# EAGLE design PrimaryLogger (EAGLE 9.6.2)

## Sheet 1 of 2
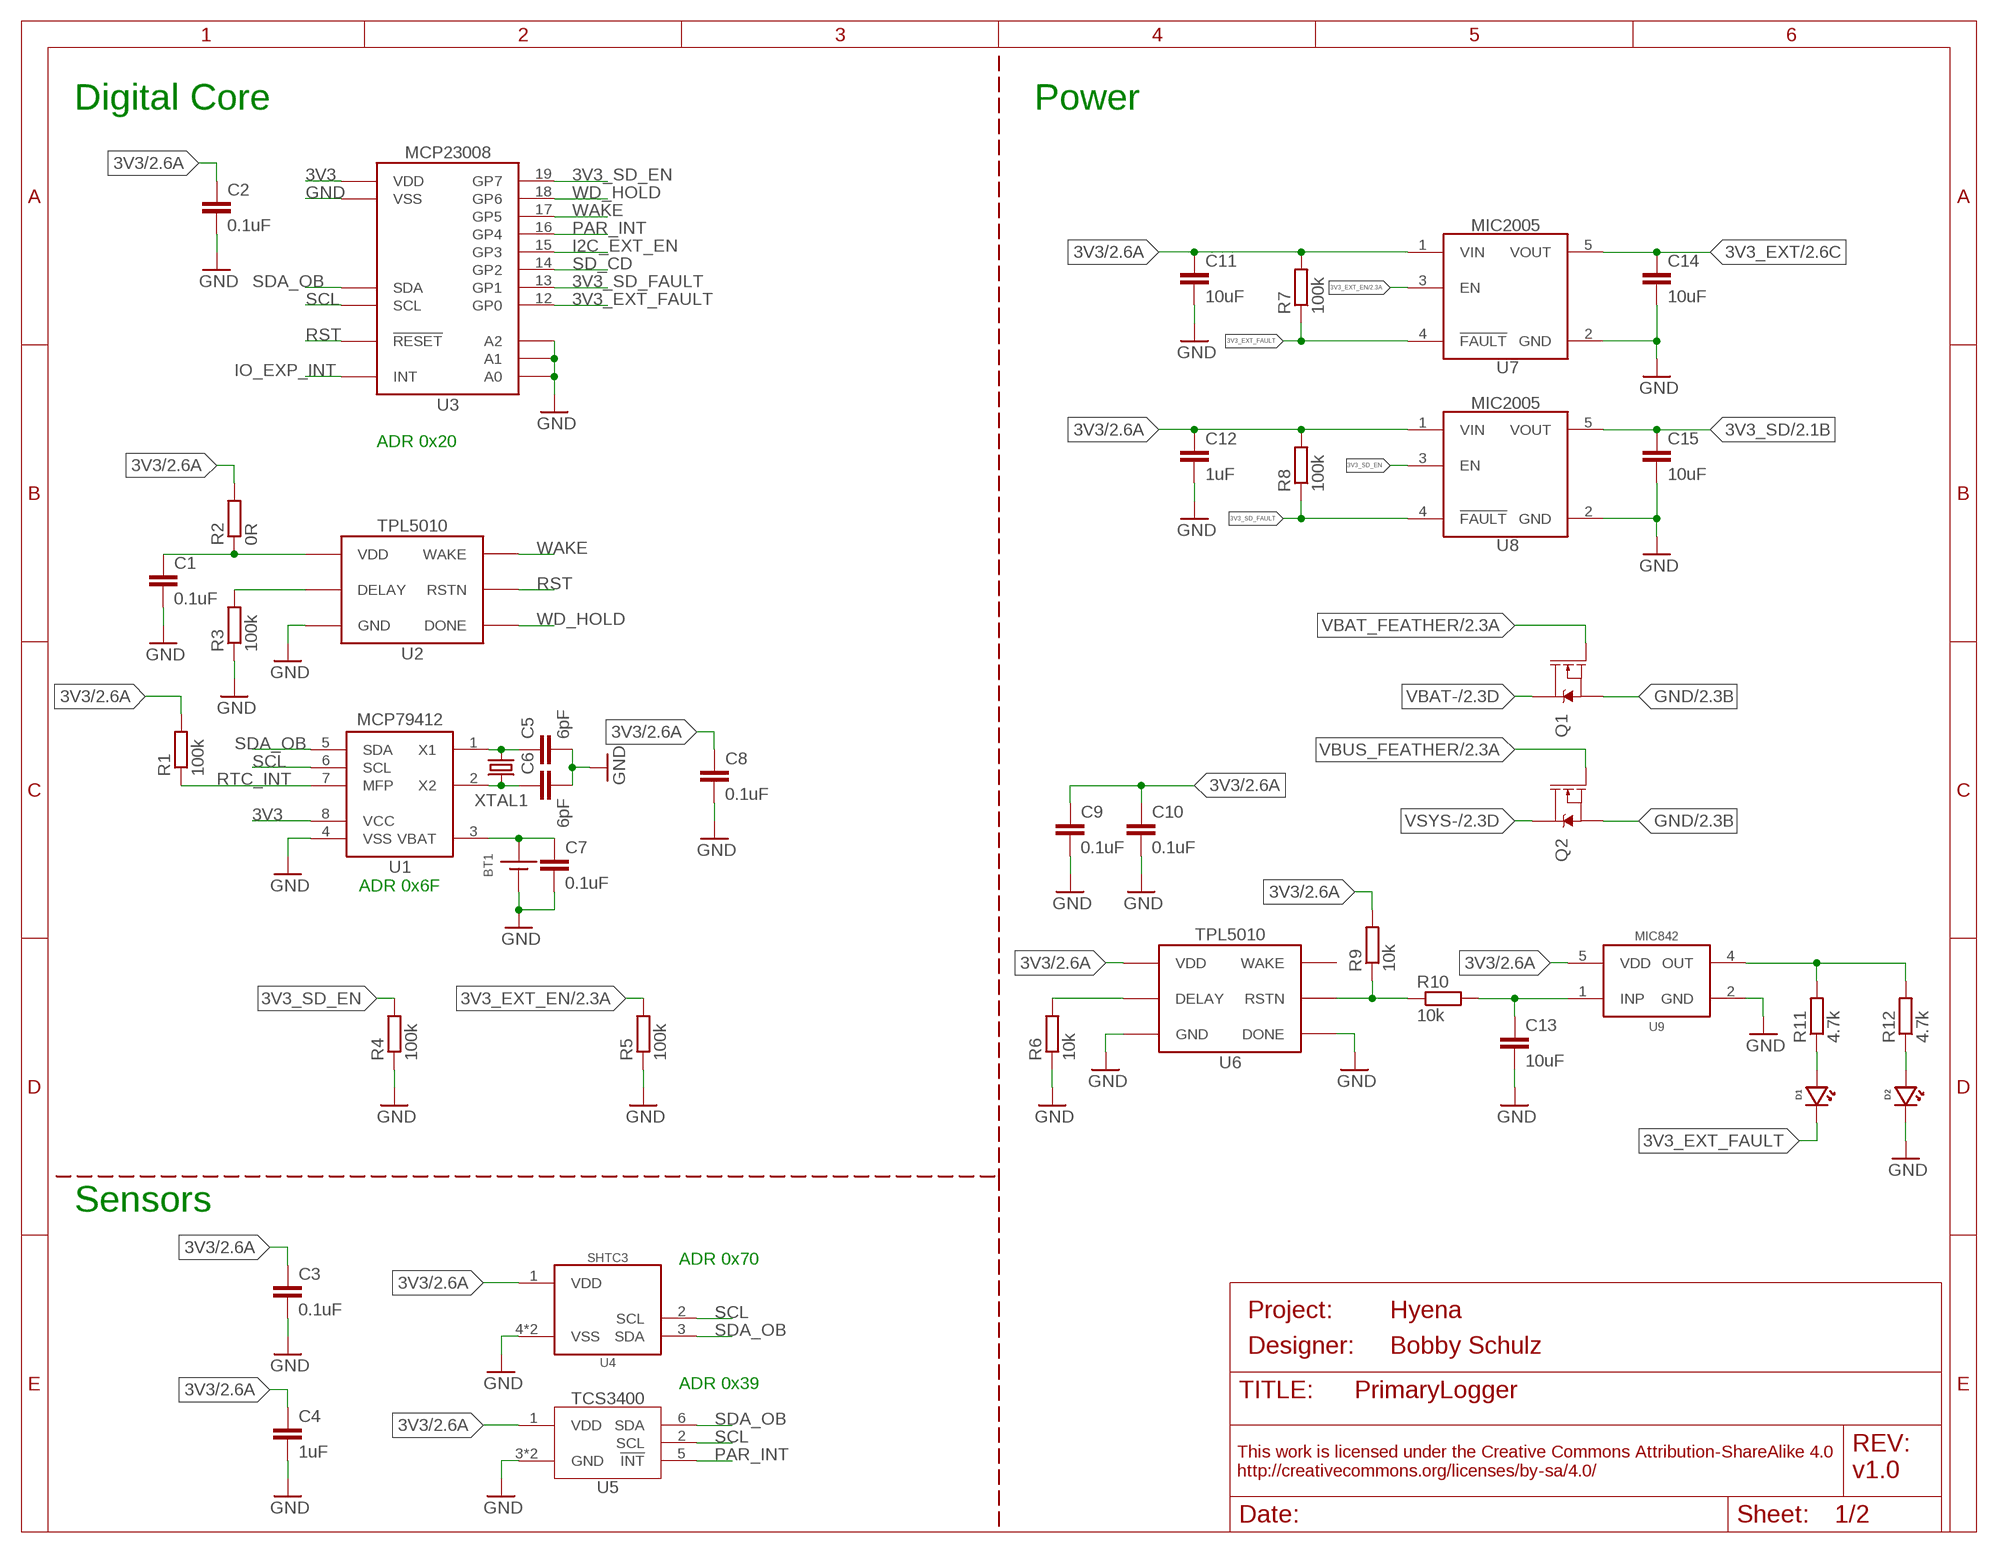
[diagram p0: schematic, sheet 1]
FRAME1 (FRAME_A_L): DESIGNER: Bobby Schulz; PROJECT: Hyena; REV: v1.0

### Parts
BT1  BATTERY_COIN12MM  [LINX_BAT-HLD-012-SMT]
C1  0.1uF  C-EU0.1UFC0603  [C0603]
C2  0.1uF  C-EU0.1UFC0603  [C0603]
C3  0.1uF  C-EU0.1UFC0603  [C0603]
C4  1uF  C-EU1UFC0603  [C0603]
C5  6pF  C-EU6PFC0402  [C0402]
C6  6pF  C-EU6PFC0402  [C0402]
C7  0.1uF  C-EU0.1UFC0603  [C0603]
C8  0.1uF  C-EU0.1UFC0603  [C0603]
C9  0.1uF  C-EU0.1UFC0603  [C0603]
C10  0.1uF  C-EU0.1UFC0603  [C0603]
C11  10uF  C-EU10UFC0805  [C0805]
C12  1uF  C-EU1UFC0603  [C0603]
C13  10uF  C-EU10UFC0805  [C0805]
C14  10uF  C-EU10UFC0805  [C0805]
C15  10uF  C-EU10UFC0805  [C0805]
D1  LEDRED0603  [LED_0603]
D2  LEDGREEN0603  [LED_0603]
Q1  DMG3404  MOSFET-NCH-DMG3404L  [SOT23-3]
Q2  DMG3404  MOSFET-NCH-DMG3404L  [SOT23-3]
R1  100k  R-EU_100KR0603  [R0603]
R2  0R  R-EU_0.0R0603  [R0603]
R3  100k  R-EU_100KR0603  [R0603]
R4  100k  R-EU_100KR0603  [R0603]
R5  100k  R-EU_100KR0603  [R0603]
R6  10k  R-EU_10KR0603  [R0603]
R7  100k  R-EU_100KR0603  [R0603]
R8  100k  R-EU_100KR0603  [R0603]
R9  10k  R-EU_10KR0603  [R0603]
R10  10k  R-EU_10KR0603  [R0603]
R11  4.7k  R-EU_4.7KR0603  [R0603]
R12  4.7k  R-EU_4.7KR0603  [R0603]
U1  MCP79412SOIC  [SO08]
U2  TPL5010DDC  [DDC_R-PDSO-G6]
U3  MCP23008SSOP  [SSOP20]
U4  SHTC3DFN  [DFN_4_2X2]
U5  TCS3400  [TCS3400]
U6  TPL5010DDC  [DDC_R-PDSO-G6]
U7  MIC2005  [SOT23-5]
U8  MIC2005  [SOT23-5]
U9  MIC842L  [DCK_R-PDSO-G5]
XTAL1  CRYSTAL3.2X1.5  [CRYSTAL_3.2X1.5_2-SMD]

### Nets
3V3: C2.1 C3.1 C4.1 C8.1 C9.1 C10.1 C11.1 C12.1 R1.2 R2.2 R7.2 R8.2 R9.2 U1.8(VCC) U3.20(VDD) U4.1(VDD) U5.1(VDD) U6.1(VDD) U7.1(VIN) U8.1(VIN) U9.5(VDD) ; also sheet 2
3V3_EXT: C14.1 U7.5(VOUT) ; also sheet 2
3V3_EXT_EN: R5.2 U7.3(EN) ; also sheet 2
3V3_EXT_FAULT: D1.CATHODE R7.1 U3.12(GP0) U7.4(!FAULT)
3V3_SD: C15.1 U8.5(VOUT) ; also sheet 2
3V3_SD_EN: R4.2 U3.19(GP7) U8.3(EN)
3V3_SD_FAULT: R8.1 U3.13(GP1) U8.4(!FAULT)
GND: BT1.GND(-) C1.2 C2.2 C3.2 C4.2 C5.2 C6.2 C7.2 C8.2 C9.2 C10.2 C11.2 C12.2 C13.2 C14.2 C15.2 D2.CATHODE Q1.2(S) Q2.2(S) R3.1 R4.1 R5.1 R6.1 U1.4(VSS) U2.2(GND) U3.3(A2) U3.4(A1) U3.5(A0) U3.9(VSS) U4.4(VSS) U4.EP(VSS) U5.3(GND) U5.4(GND) U6.2(GND) U6.4(DONE) U7.2(GND) U8.2(GND) U9.2(GND) ; also sheet 2
I2C_EXT_EN: U3.15(GP3) ; also sheet 2
IO_EXP_INT: U3.8(INT) ; also sheet 2
N$1: C5.1 U1.1(X1) XTAL1.P$1
N$2: C6.1 U1.2(X2) XTAL1.P$2
N$3: R3.2 U2.3(DELAY)
N$6: C1.1 R2.1 U2.1(VDD)
N$7: R6.2 U6.3(DELAY)
N$8: C13.1 R10.2 U9.1(INP)
N$9: R9.1 R10.1 U6.6(RSTN)
N$10: R11.2 R12.2 U9.4(OUT)
N$11: D1.ANODE R11.1
N$12: D2.ANODE R12.1
PAR_INT: U3.16(GP4) U5.5(!INT) ; also sheet 2
RST: U2.6(RSTN) U3.6(!RESET) ; also sheet 2
RTC_INT: R1.1 U1.7(MFP) ; also sheet 2
SCL: U1.6(SCL) U3.1(SCL) U4.2(SCL) U5.2(SCL) ; also sheet 2
SD_CD: U3.14(GP2) ; also sheet 2
SDA_OB: U1.5(SDA) U3.2(SDA) U4.3(SDA) U5.6(SDA) ; also sheet 2
VBAT: BT1.POWER0(+) BT1.POWER1(+) C7.1 U1.3(VBAT)
VBAT-: Q1.3(D) ; also sheet 2
VBAT_FEATHER: Q1.1(G) ; also sheet 2
VBUS_FEATHER: Q2.1(G) ; also sheet 2
VSYS-: Q2.3(D) ; also sheet 2
WAKE: U2.5(WAKE) U3.17(GP5)
WD_HOLD: U2.4(DONE) U3.18(GP6)
Unconnected: U6.5(WAKE)

### Notes on the sheet
- Digital Core | Power
- ADR 0x20
- ADR 0x6F
- Sensors
- ADR 0x70
- ADR 0x39

## Sheet 2 of 2
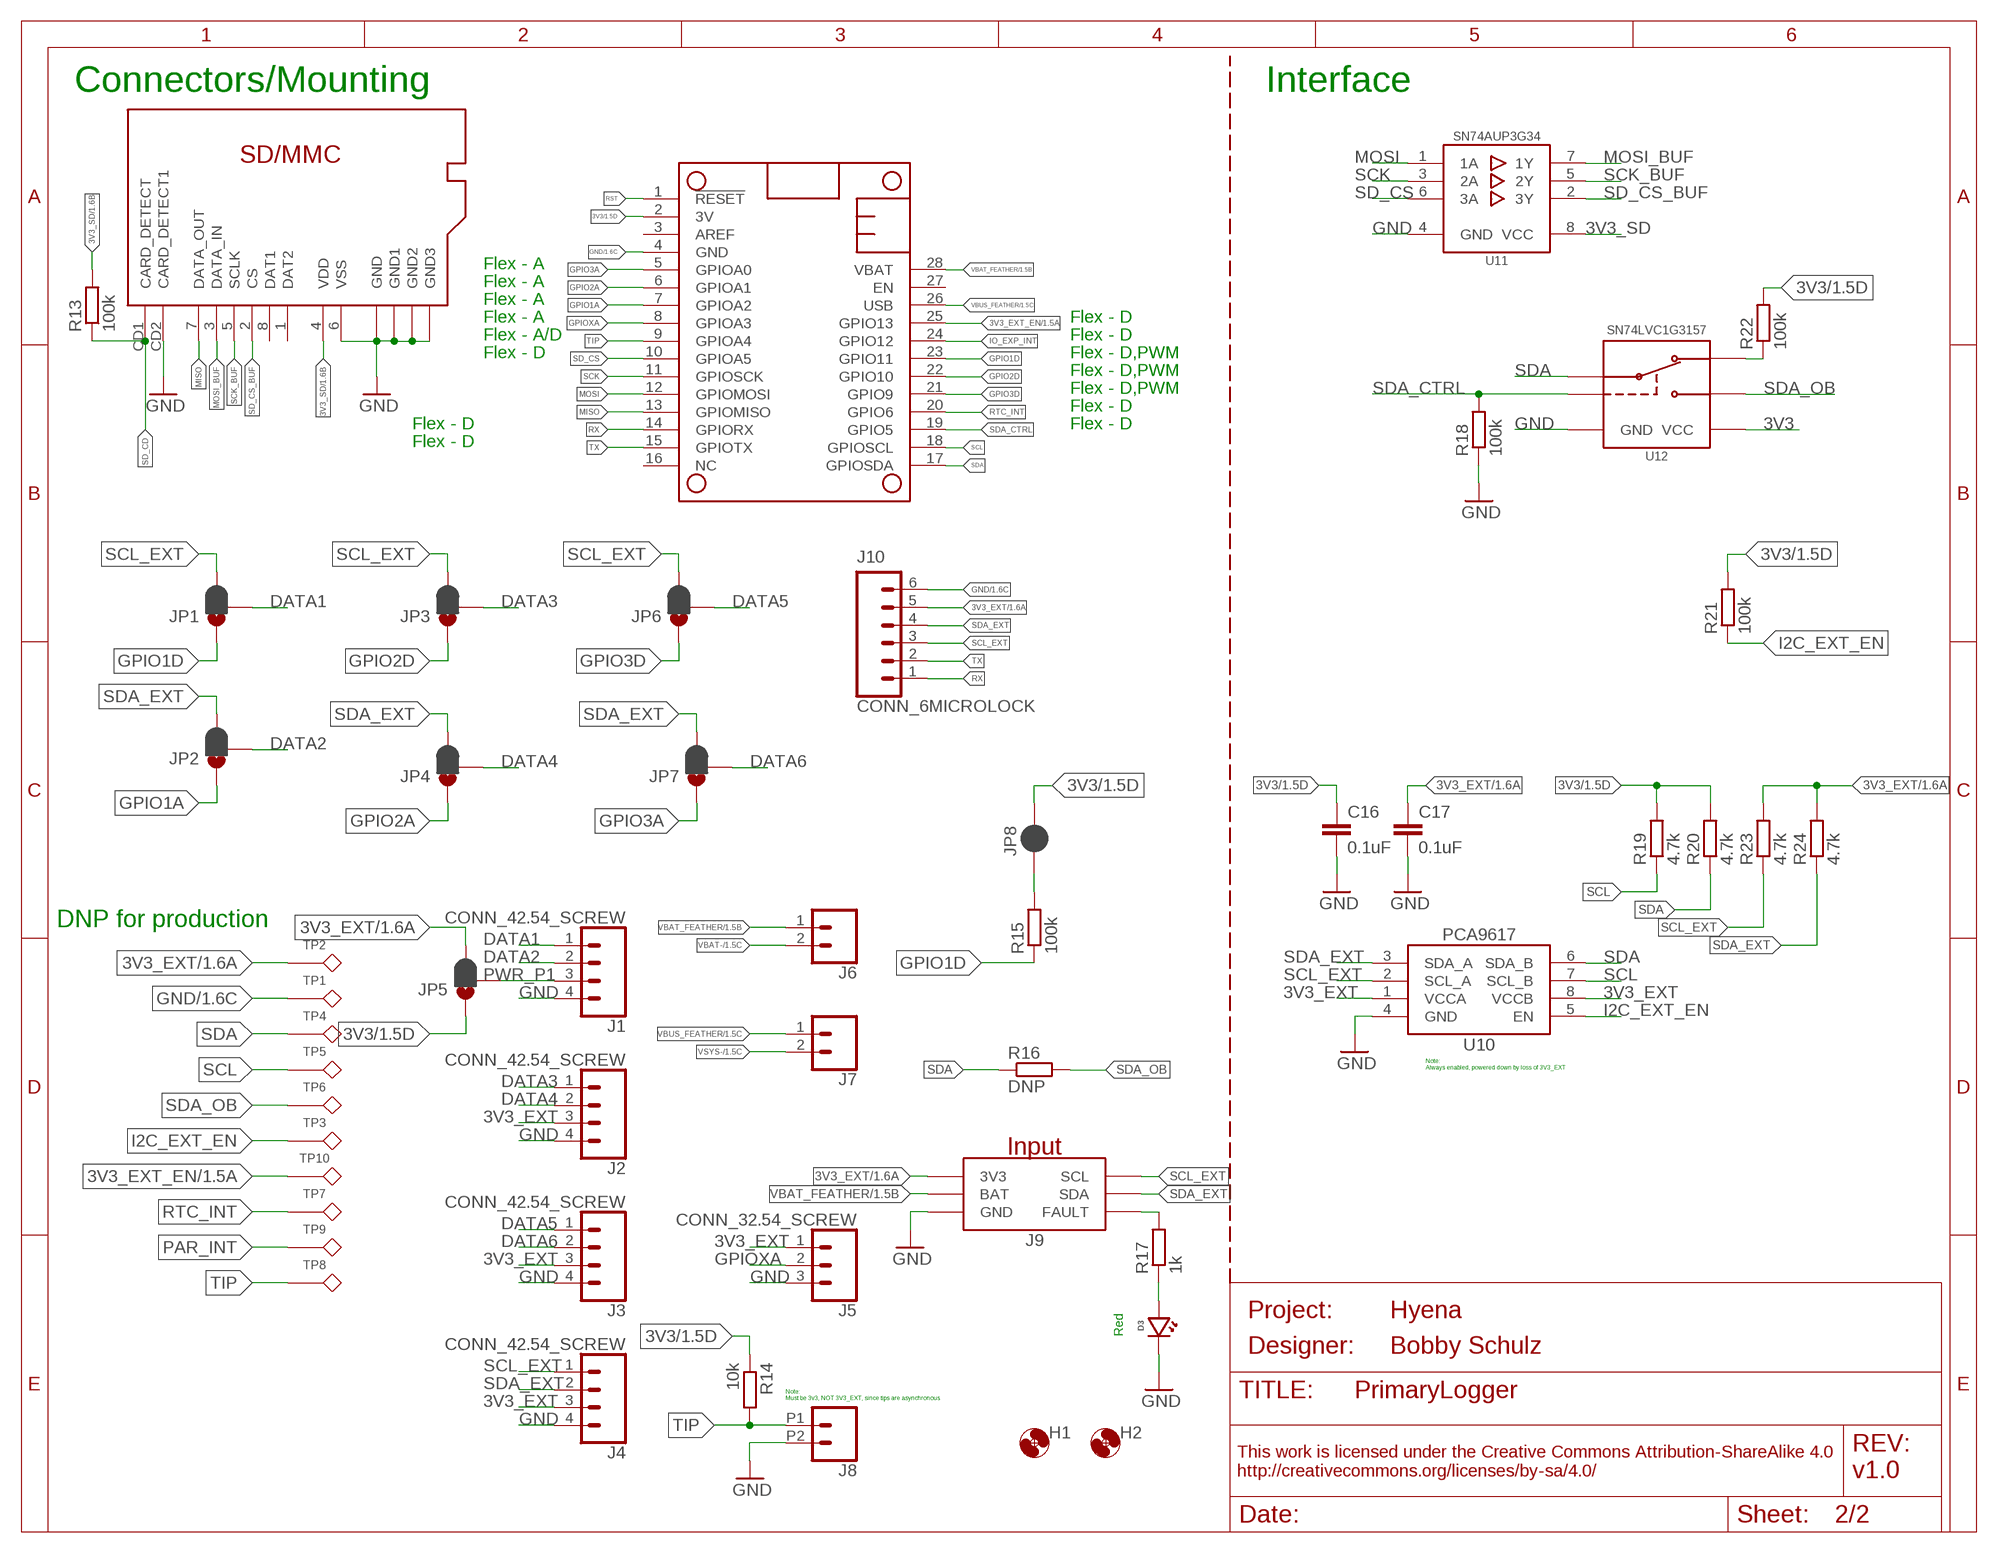
[diagram p1: schematic, sheet 2]
FRAME2 (FRAME_A_L): DESIGNER: Bobby Schulz; PROJECT: Hyena; REV: v1.0

### Parts
C16  0.1uF  C-EU0.1UFC0603  [C0603]
C17  0.1uF  C-EU0.1UFC0603  [C0603]
D3  LEDRED0603  [LED_0603]
H1  MOUNTING_HOLE2_NP  [2_56]
H2  MOUNTING_HOLE2_NP  [2_56]
J1  CONN_42.54_SCREW  [1X04_SCREW]
J2  CONN_42.54_SCREW  [1X04_SCREW]
J3  CONN_42.54_SCREW  [1X04_SCREW]
J4  CONN_42.54_SCREW  [1X04_SCREW]
J5  CONN_32.54_SCREW  [1X03_SCREW]
J6  CONN_023.5MM_ROUND  [SCREWTERMINAL-3.5MM-2_ROUND]
J7  CONN_023.5MM_ROUND  [SCREWTERMINAL-3.5MM-2_ROUND]
J8  CONN_022.54_SCREW_ROUND  [1X02_2.54_SCREWTERM_ROUND]
J9  GEMS_POWER_PLUGINPUT  [2X3_MICROFIT_RT]
J10  CONN_6MICROLOCK  [1X06_MICROLOCKPLUS]
JP1  JUMPER-SMT_3_1-NC_PASTE_SILK  [SMT-JUMPER_3_1-NC_PASTE_SILK]
JP2  JUMPER-SMT_3_1-NC_PASTE_SILK  [SMT-JUMPER_3_1-NC_PASTE_SILK]
JP3  JUMPER-SMT_3_1-NC_PASTE_SILK  [SMT-JUMPER_3_1-NC_PASTE_SILK]
JP4  JUMPER-SMT_3_1-NC_PASTE_SILK  [SMT-JUMPER_3_1-NC_PASTE_SILK]
JP5  JUMPER-SMT_3_1-NC_PASTE_SILK  [SMT-JUMPER_3_1-NC_PASTE_SILK]
JP6  JUMPER-SMT_3_1-NC_PASTE_SILK  [SMT-JUMPER_3_1-NC_PASTE_SILK]
JP7  JUMPER-SMT_3_1-NC_PASTE_SILK  [SMT-JUMPER_3_1-NC_PASTE_SILK]
JP8  JUMPER-SMT_2_NC_PASTE_SILK  [SMT-JUMPER_2_NC_PASTE_SILK]
MS1  FEATHERWINGLAYOUT  [FEATHERWING_MIN]
R13  100k  R-EU_100KR0603  [R0603]
R14  10k  R-EU_10KR0603  [R0603]
R15  100k  R-EU_100KR0603  [R0603]
R16  DNP  R-EU_0.0R0603  [R0603]
R17  1k  R-EU_1KR0603  [R0603]
R18  100k  R-EU_100KR0603  [R0603]
R19  4.7k  R-EU_4.7KR0603  [R0603]
R20  4.7k  R-EU_4.7KR0603  [R0603]
R21  100k  R-EU_100KR0603  [R0603]
R22  100k  R-EU_100KR0603  [R0603]
R23  4.7k  R-EU_4.7KR0603  [R0603]
R24  4.7k  R-EU_4.7KR0603  [R0603]
SD1  MICRO_SD  [CUSTOM-PARTS_SD_MICRO]
TP1  TESTPOINTRCU  [TESTPOINT_0603]
TP2  TESTPOINTRCU  [TESTPOINT_0603]
TP3  TESTPOINTRCU  [TESTPOINT_0603]
TP4  TESTPOINTRCU  [TESTPOINT_0603]
TP5  TESTPOINTRCU  [TESTPOINT_0603]
TP6  TESTPOINTRCU  [TESTPOINT_0603]
TP7  TESTPOINTRCU  [TESTPOINT_0603]
TP8  TESTPOINTRCU  [TESTPOINT_0603]
TP9  TESTPOINTRCU  [TESTPOINT_0603]
TP10  TESTPOINTRCU  [TESTPOINT_0603]
U10  PCA9617  [TSSOP_8]
U11  SN74AUP3G34DCU  [DCU_(R-PDSO-G8)]
U12  SN74LVC1G3157SC70  [DCK_R-PDSO-G6]

### Nets
3V3: C16.1 JP5.1 JP8.2 MS1.2(3V) R14.1 R19.2 R20.2 R21.2 R22.2 U12.5(VCC) ; also sheet 1
3V3_EXT: C17.1 J2.3 J3.3 J4.3 J5.1 J9.5(3V3) J10.5 JP5.3 R23.2 R24.2 TP2.1 U10.1(VCCA) U10.8(VCCB) ; also sheet 1
3V3_EXT_EN: MS1.25(GPIO13) TP10.1 ; also sheet 1
3V3_SD: R13.2 SD1.4(VDD) U11.8(VCC) ; also sheet 1
DATA1: J1.1 JP1.2
DATA2: J1.2 JP2.2
DATA3: J2.1 JP3.2
DATA4: J2.2 JP4.2
DATA5: J3.1 JP6.2
DATA6: J3.2 JP7.2
GND: C16.2 C17.2 D3.CATHODE J1.4 J2.4 J3.4 J4.4 J5.3 J8.P2 J9.2(GND) J10.6 MS1.4(GND) R18.1 SD1.6(VSS) SD1.CD2(CARD_DETECT1) SD1.GND@1(GND) SD1.GND@2(GND1) SD1.GND@3(GND2) SD1.GND@5(GND3) TP1.1 U10.4(GND) U11.4(GND) U12.2(GND) ; also sheet 1
GPIO1A: JP2.1 MS1.7(GPIOA2)
GPIO1D: JP1.1 MS1.23(GPIO11) R15.1
GPIO2A: JP4.1 MS1.6(GPIOA1)
GPIO2D: JP3.1 MS1.22(GPIO10)
GPIO3A: JP7.1 MS1.5(GPIOA0)
GPIO3D: JP6.1 MS1.21(GPIO9)
GPIOXA: J5.2 MS1.8(GPIOA3)
I2C_EXT_EN: R21.1 TP3.1 U10.5(EN) ; also sheet 1
IO_EXP_INT: MS1.24(GPIO12) ; also sheet 1
MISO: MS1.13(GPIOMISO) SD1.7(DATA_OUT)
MOSI: MS1.12(GPIOMOSI) U11.1(1A)
MOSI_BUF: SD1.3(DATA_IN) U11.7(1Y)
N$4: R22.1 U12.3(B1)
N$5: JP8.1 R15.2
N$13: J9.3(FAULT) R17.2
N$14: D3.ANODE R17.1
PAR_INT: TP9.1 ; also sheet 1
PWR_P1: J1.3 JP5.2
RST: MS1.1(!RESET) ; also sheet 1
RTC_INT: MS1.20(GPIO6) TP7.1 ; also sheet 1
RX: J10.1 MS1.14(GPIORX)
SCK: MS1.11(GPIOSCK) U11.3(2A)
SCK_BUF: SD1.5(SCLK) U11.5(2Y)
SCL: MS1.18(GPIOSCL) R19.1 TP5.1 U10.7(SCL_B) ; also sheet 1
SCL_EXT: J4.1 J9.6(SCL) J10.3 JP1.3 JP3.3 JP6.3 R23.1 U10.2(SCL_A)
SD_CD: R13.1 SD1.CD1(CARD_DETECT) ; also sheet 1
SD_CS: MS1.10(GPIOA5) U11.6(3A)
SD_CS_BUF: SD1.2(CS) U11.2(3Y)
SDA: MS1.17(GPIOSDA) R16.1 R20.1 TP4.1 U10.6(SDA_B) U12.4(A)
SDA_CTRL: MS1.19(GPIO5) R18.2 U12.6(S)
SDA_EXT: J4.2 J9.4(SDA) J10.4 JP2.3 JP4.3 JP7.3 R24.1 U10.3(SDA_A)
SDA_OB: R16.2 TP6.1 U12.1(B2) ; also sheet 1
TIP: J8.P1 MS1.9(GPIOA4) R14.2 TP8.1
TX: J10.2 MS1.15(GPIOTX)
VBAT-: J6.2 ; also sheet 1
VBAT_FEATHER: J6.1 J9.1(BAT) MS1.28(VBAT) ; also sheet 1
VBUS_FEATHER: J7.1 MS1.26(USB) ; also sheet 1
VSYS-: J7.2 ; also sheet 1
Unconnected: MS1.3(AREF) MS1.16(NC) MS1.27(EN) SD1.1(DAT2) SD1.8(DAT1)

### Notes on the sheet
- Connectors/Mounting | Interface
- Flex - A
- Flex - A
- Flex - A
- Flex - A | Flex - D
- Flex - A/D | Flex - D
- Flex - D | Flex - D,PWM
- Flex - D,PWM
- Flex - D,PWM
- Flex - D
- Flex - D | Flex - D
- Flex - D
- DNP for production
- Note:
  Always enabled, powered down by loss of 3V3_EXT
- Red
- Note:
  Must be 3v3, NOT 3V3_EXT, since tips are asynchronous

## Library data of the parts
BT1 = bschulz:BATTERY_COIN: Coin Cell Battery Holder; DIGIKEY: BAT-HLD-012-SMT-ND; MF: Linx; MPN: BAT-HLD-012-SMT
C1-C3 C7-C10 C16 C17 = bschulz_passives:C-EU: CAPACITOR, European symbol; DIGIKEY: 490-6051-1-ND; MF: Murata; MPN: GCM188R71E104KA57D
C4 C12 = bschulz_passives:C-EU: CAPACITOR, European symbol; DIGIKEY: 587-1251-1-ND; MF: Yaiyo Yuden; MPN: EMK107BJ105KA-T
C5 C6 = bschulz_passives:C-EU: CAPACITOR, European symbol; DIGIKEY: 490-3104-1-ND; MF: Murata; MPN: GJM1555C1H6R0CB01D
C11 C13-C15 = bschulz_passives:C-EU: CAPACITOR, European symbol; DIGIKEY: 490-6473-1-ND; MF: Murata; MPN: GRM21BR61C106KE15K
D1 D3 = bschulz:LED: Genaric LED; DIGIKEY: 732-4978-1-ND; MF: Wurth; MPN: 150060RS75000
D2 = bschulz:LED: Genaric LED; DIGIKEY: 732-4971-1-ND; MF: Wurth; MPN: 150060GS75000
H1 H2 = bschulz:MOUNTING_HOLE: Genaric Mechanical Mounting Hole Hole diameter based on max body diameter + 15% Keepout ring is for diameter of socket cap screw (minimum required clearance) TPlace ring is for diameter of pan head screw (recomended clearance) Specifications: Socket Cap <http://fastener-express.com/fastener-technical/SocketscapSS-Alloy.pdf> Button Head Socket Cap <http://fastener-express.com/fastener-technical/Button-Socket-alloy.pdf> Pan Head <http://fastener-express.com/fastener-technical/pan-machine-Screws.pdf>; DIGIKEY: DNP; MF: N/A; MPN: DNP
J1-J4 = bschulz:CONN_4: Genaric 4 terminal header Digikey 2.54_SCREW <https://www.digikey.com/product-detail/en/on-shore-technology-inc/OSTVN04A150/ED10563-ND/1588864>; DIGIKEY: ED10563-ND; MF: On Shore; MPN: OSTVN04A150
J5 = bschulz:CONN_3: Genaric 3 terminal header Digikey 2.54_SCREW <https://www.digikey.com/product-detail/en/on-shore-technology-inc/OSTVN03A150/ED10562-ND/1588863> 3.5_SCREW <https://www.digikey.com/product-detail/en/on-shore-technology-inc/OSTTE030161/ED2636-ND/614585>; DIGIKEY: ED10562-ND; MF: On Shore; MPN: OSTVN03A150
J6 J7 = bschulz:CONN_02: Genaric 2 terminal header SCREW_2.54 <https://www.digikey.com/product-detail/en/on-shore-technology-inc/OSTVN02A150/ED10561-ND/1588862> 39532_RA <https://www.digikey.com/product-detail/en/molex/0395321002/WM7845-ND/1280696>; DIGIKEY: ED2635-ND; MF: OnShore; MPN: OSTTE020161
J8 = bschulz:CONN_02: Genaric 2 terminal header SCREW_2.54 <https://www.digikey.com/product-detail/en/on-shore-technology-inc/OSTVN02A150/ED10561-ND/1588862> 39532_RA <https://www.digikey.com/product-detail/en/molex/0395321002/WM7845-ND/1280696>; DIGIKEY: ED10561-ND; MF: OnShore; MPN: OSTVN02A150
J9 = bschulz:GEMS_POWER_PLUG: Power Plug For GEMS Based Systems Both Input and Output versions; DIGIKEY: WM1815-ND; DISP: Input; MF: Molex; MPN: 0430450600
J10 = bschulz:CONN_6: Genaric 6 terminal header Digikey 2.54_SCREW <https://www.digikey.com/product-detail/en/on-shore-technology-inc/OSTVN06A150/ED10565-ND/1588866>; DIGIKEY: 900-2059570671CT-ND; MF: Molex; MPN: 2059570671
JP1-JP7 = bschulz:JUMPER-SMT_3_1-NC_PASTE: Normally closed solder jumper (1 of 2 connections) This jumper has an aperture in the stencil to allow solder paste to bridge one of the two connections. One connection is normally closed (NC), while the other is normally open (NO). Wick off the solder to open the connection. Reapply solder to reclose the connection. Apply solder to the other side instead to change the current path.; DIGIKEY: DNP; MF: N/A; MPN: N/A
JP8 = bschulz:JUMPER-SMT_2_NC_PASTE: Normally closed solder jumper This jumper has an aperture in the stencil to allow solder paste to bridge the split in the wire so it's normally closed (NC). Wick off the solder to open the connection. Reapply solder to reclose the connection.; DIGIKEY: DNP; MF: N/A; MPN: N/A
MS1 = bschulz:FEATHERWING
Q1 Q2 = bschulz:MOSFET-NCH: N-channel MOSFETs Voltage controlled devices that allow control of high current outputs. SparkFun Products: SparkFun OpenScale <https://www.sparkfun.com/products/13261> SparkFun Digital Sandbox <https://www.sparkfun.com/products/12651> SparkFun Monster Moto Shield <https://www.sparkfun.com/products/10182> SparkFun MOSFET Power Controller <https://www.sparkfun.com/products/11214>; DIGIKEY: DMG3404L-7DICT-ND; MF: Diodes Incorporated; MPN: DMG3404L-7
R1 R3-R5 R7 R8 R13 R15 R18 R21 R22 = bschulz_passives:R-EU_: RESISTOR, European symbol Digikey Parts: Yageo, 0402 <https://www.digikey.com/products/en/resistors/chip-resistor-surface-mount/52?k=&pkeyword=&sv=0&s=4356&sf=1&FV=-1%7C13%2C7%7C2%2C1291%7C39157%2C1989%7C0%2C-8%7C52%2C3%7C1131%2C3%7C2503&quantity=&ColumnSort=0&page=1&stock=1&pageSize=25> Yageo, 0603 <https://www.digikey.com/products/en/resistors/chip-resistor-surface-mount/52?k=&pkeyword=&sv=0&pv1291=39245&sf=1&FV=-5%7C4356%2C-5%7C47360%2C-8%7C52%2C-1%7C13%2C7%7C2%2C1989%7C0&quantity=10&ColumnSort=1000011&page=1&stock=1&pageSize=25> Panasonic, 0603 <https://www.digikey.com/products/en/resistors/chip-resistor-surface-mount/52?k=&pkeyword=&pv252=68&sf=0&FV=ffec373d%2C1c0002%2C142c040c%2C1f140000%2Cffe00034%2C80002%2Cc0001&quantity=&ColumnSort=0&page=1&stock=1&pageSize=25> Panasonic, precision, 0603 <https://www.digikey.com/products/en/resistors/chip-resistor-surface-mount/52?FV=ffec4907%2Cfffc000a%2Cc0172%2C142c040c%2C1f140000%2Cffe00034%2C1c0002&quantity=100&ColumnSort=2085&page=1&stock=1&pageSize=25> Panasonic, 0805 <https://www.digikey.com/products/en/resistors/chip-resistor-surface-mount/52?k=&pkeyword=&pv3=1&sf=0&FV=ffec373d%2C1c0002%2C1f140000%2Cffe00034%2C142c040d&quantity=&ColumnSort=0&page=1&stock=1&pageSize=25> Rohm, current sense <https://www.digikey.com/products/en/resistors/chip-resistor-surface-mount/52?k=&pkeyword=&pv3=1&sf=0&FV=ffecb688%2C1f140000%2Cffe00034%2C1c0002&quantity=&ColumnSort=0&page=1&stock=1&pageSize=25> Vishay, pulse proof automotive <https://www.digikey.com/products/en/resistors/chip-resistor-surface-mount/52?k=&pkeyword=&pv7=2&sf=0&FV=ffec5d6b%2Cffe00034%2C1f140000&quantity=&ColumnSort=0&page=1&stock=1&pageSize=25>; DIGIKEY: 311-100KHRCT-ND; MF: Yageo; MPN: RC0603FR-07100KL; VALUE_PART: 100k
R2 R16 = bschulz_passives:R-EU_: RESISTOR, European symbol Digikey Parts: Yageo, 0402 <https://www.digikey.com/products/en/resistors/chip-resistor-surface-mount/52?k=&pkeyword=&sv=0&s=4356&sf=1&FV=-1%7C13%2C7%7C2%2C1291%7C39157%2C1989%7C0%2C-8%7C52%2C3%7C1131%2C3%7C2503&quantity=&ColumnSort=0&page=1&stock=1&pageSize=25> Yageo, 0603 <https://www.digikey.com/products/en/resistors/chip-resistor-surface-mount/52?k=&pkeyword=&sv=0&pv1291=39245&sf=1&FV=-5%7C4356%2C-5%7C47360%2C-8%7C52%2C-1%7C13%2C7%7C2%2C1989%7C0&quantity=10&ColumnSort=1000011&page=1&stock=1&pageSize=25> Panasonic, 0603 <https://www.digikey.com/products/en/resistors/chip-resistor-surface-mount/52?k=&pkeyword=&pv252=68&sf=0&FV=ffec373d%2C1c0002%2C142c040c%2C1f140000%2Cffe00034%2C80002%2Cc0001&quantity=&ColumnSort=0&page=1&stock=1&pageSize=25> Panasonic, precision, 0603 <https://www.digikey.com/products/en/resistors/chip-resistor-surface-mount/52?FV=ffec4907%2Cfffc000a%2Cc0172%2C142c040c%2C1f140000%2Cffe00034%2C1c0002&quantity=100&ColumnSort=2085&page=1&stock=1&pageSize=25> Panasonic, 0805 <https://www.digikey.com/products/en/resistors/chip-resistor-surface-mount/52?k=&pkeyword=&pv3=1&sf=0&FV=ffec373d%2C1c0002%2C1f140000%2Cffe00034%2C142c040d&quantity=&ColumnSort=0&page=1&stock=1&pageSize=25> Rohm, current sense <https://www.digikey.com/products/en/resistors/chip-resistor-surface-mount/52?k=&pkeyword=&pv3=1&sf=0&FV=ffecb688%2C1f140000%2Cffe00034%2C1c0002&quantity=&ColumnSort=0&page=1&stock=1&pageSize=25> Vishay, pulse proof automotive <https://www.digikey.com/products/en/resistors/chip-resistor-surface-mount/52?k=&pkeyword=&pv7=2&sf=0&FV=ffec5d6b%2Cffe00034%2C1f140000&quantity=&ColumnSort=0&page=1&stock=1&pageSize=25>; DIGIKEY: 311-0.0LECT-ND; MF: Yageo; MPN: AC0603JR-070RL; VALUE_PART: 0
R6 R9 R10 R14 = bschulz_passives:R-EU_: RESISTOR, European symbol Digikey Parts: Yageo, 0402 <https://www.digikey.com/products/en/resistors/chip-resistor-surface-mount/52?k=&pkeyword=&sv=0&s=4356&sf=1&FV=-1%7C13%2C7%7C2%2C1291%7C39157%2C1989%7C0%2C-8%7C52%2C3%7C1131%2C3%7C2503&quantity=&ColumnSort=0&page=1&stock=1&pageSize=25> Yageo, 0603 <https://www.digikey.com/products/en/resistors/chip-resistor-surface-mount/52?k=&pkeyword=&sv=0&pv1291=39245&sf=1&FV=-5%7C4356%2C-5%7C47360%2C-8%7C52%2C-1%7C13%2C7%7C2%2C1989%7C0&quantity=10&ColumnSort=1000011&page=1&stock=1&pageSize=25> Panasonic, 0603 <https://www.digikey.com/products/en/resistors/chip-resistor-surface-mount/52?k=&pkeyword=&pv252=68&sf=0&FV=ffec373d%2C1c0002%2C142c040c%2C1f140000%2Cffe00034%2C80002%2Cc0001&quantity=&ColumnSort=0&page=1&stock=1&pageSize=25> Panasonic, precision, 0603 <https://www.digikey.com/products/en/resistors/chip-resistor-surface-mount/52?FV=ffec4907%2Cfffc000a%2Cc0172%2C142c040c%2C1f140000%2Cffe00034%2C1c0002&quantity=100&ColumnSort=2085&page=1&stock=1&pageSize=25> Panasonic, 0805 <https://www.digikey.com/products/en/resistors/chip-resistor-surface-mount/52?k=&pkeyword=&pv3=1&sf=0&FV=ffec373d%2C1c0002%2C1f140000%2Cffe00034%2C142c040d&quantity=&ColumnSort=0&page=1&stock=1&pageSize=25> Rohm, current sense <https://www.digikey.com/products/en/resistors/chip-resistor-surface-mount/52?k=&pkeyword=&pv3=1&sf=0&FV=ffecb688%2C1f140000%2Cffe00034%2C1c0002&quantity=&ColumnSort=0&page=1&stock=1&pageSize=25> Vishay, pulse proof automotive <https://www.digikey.com/products/en/resistors/chip-resistor-surface-mount/52?k=&pkeyword=&pv7=2&sf=0&FV=ffec5d6b%2Cffe00034%2C1f140000&quantity=&ColumnSort=0&page=1&stock=1&pageSize=25>; DIGIKEY: 311-10.0KHRCT-ND; MF: Yageo; MPN: RC0603FR-0710KL; VALUE_PART: 10k
R11 R12 R19 R20 R23 R24 = bschulz_passives:R-EU_: RESISTOR, European symbol Digikey Parts: Yageo, 0402 <https://www.digikey.com/products/en/resistors/chip-resistor-surface-mount/52?k=&pkeyword=&sv=0&s=4356&sf=1&FV=-1%7C13%2C7%7C2%2C1291%7C39157%2C1989%7C0%2C-8%7C52%2C3%7C1131%2C3%7C2503&quantity=&ColumnSort=0&page=1&stock=1&pageSize=25> Yageo, 0603 <https://www.digikey.com/products/en/resistors/chip-resistor-surface-mount/52?k=&pkeyword=&sv=0&pv1291=39245&sf=1&FV=-5%7C4356%2C-5%7C47360%2C-8%7C52%2C-1%7C13%2C7%7C2%2C1989%7C0&quantity=10&ColumnSort=1000011&page=1&stock=1&pageSize=25> Panasonic, 0603 <https://www.digikey.com/products/en/resistors/chip-resistor-surface-mount/52?k=&pkeyword=&pv252=68&sf=0&FV=ffec373d%2C1c0002%2C142c040c%2C1f140000%2Cffe00034%2C80002%2Cc0001&quantity=&ColumnSort=0&page=1&stock=1&pageSize=25> Panasonic, precision, 0603 <https://www.digikey.com/products/en/resistors/chip-resistor-surface-mount/52?FV=ffec4907%2Cfffc000a%2Cc0172%2C142c040c%2C1f140000%2Cffe00034%2C1c0002&quantity=100&ColumnSort=2085&page=1&stock=1&pageSize=25> Panasonic, 0805 <https://www.digikey.com/products/en/resistors/chip-resistor-surface-mount/52?k=&pkeyword=&pv3=1&sf=0&FV=ffec373d%2C1c0002%2C1f140000%2Cffe00034%2C142c040d&quantity=&ColumnSort=0&page=1&stock=1&pageSize=25> Rohm, current sense <https://www.digikey.com/products/en/resistors/chip-resistor-surface-mount/52?k=&pkeyword=&pv3=1&sf=0&FV=ffecb688%2C1f140000%2Cffe00034%2C1c0002&quantity=&ColumnSort=0&page=1&stock=1&pageSize=25> Vishay, pulse proof automotive <https://www.digikey.com/products/en/resistors/chip-resistor-surface-mount/52?k=&pkeyword=&pv7=2&sf=0&FV=ffec5d6b%2Cffe00034%2C1f140000&quantity=&ColumnSort=0&page=1&stock=1&pageSize=25>; DIGIKEY: 311-4.70KHRCT-ND; MF: Yageo; MPN: RC0603FR-074K7L; VALUE_PART: 4.7k
R17 = bschulz_passives:R-EU_: RESISTOR, European symbol Digikey Parts: Yageo, 0402 <https://www.digikey.com/products/en/resistors/chip-resistor-surface-mount/52?k=&pkeyword=&sv=0&s=4356&sf=1&FV=-1%7C13%2C7%7C2%2C1291%7C39157%2C1989%7C0%2C-8%7C52%2C3%7C1131%2C3%7C2503&quantity=&ColumnSort=0&page=1&stock=1&pageSize=25> Yageo, 0603 <https://www.digikey.com/products/en/resistors/chip-resistor-surface-mount/52?k=&pkeyword=&sv=0&pv1291=39245&sf=1&FV=-5%7C4356%2C-5%7C47360%2C-8%7C52%2C-1%7C13%2C7%7C2%2C1989%7C0&quantity=10&ColumnSort=1000011&page=1&stock=1&pageSize=25> Panasonic, 0603 <https://www.digikey.com/products/en/resistors/chip-resistor-surface-mount/52?k=&pkeyword=&pv252=68&sf=0&FV=ffec373d%2C1c0002%2C142c040c%2C1f140000%2Cffe00034%2C80002%2Cc0001&quantity=&ColumnSort=0&page=1&stock=1&pageSize=25> Panasonic, precision, 0603 <https://www.digikey.com/products/en/resistors/chip-resistor-surface-mount/52?FV=ffec4907%2Cfffc000a%2Cc0172%2C142c040c%2C1f140000%2Cffe00034%2C1c0002&quantity=100&ColumnSort=2085&page=1&stock=1&pageSize=25> Panasonic, 0805 <https://www.digikey.com/products/en/resistors/chip-resistor-surface-mount/52?k=&pkeyword=&pv3=1&sf=0&FV=ffec373d%2C1c0002%2C1f140000%2Cffe00034%2C142c040d&quantity=&ColumnSort=0&page=1&stock=1&pageSize=25> Rohm, current sense <https://www.digikey.com/products/en/resistors/chip-resistor-surface-mount/52?k=&pkeyword=&pv3=1&sf=0&FV=ffecb688%2C1f140000%2Cffe00034%2C1c0002&quantity=&ColumnSort=0&page=1&stock=1&pageSize=25> Vishay, pulse proof automotive <https://www.digikey.com/products/en/resistors/chip-resistor-surface-mount/52?k=&pkeyword=&pv7=2&sf=0&FV=ffec5d6b%2Cffe00034%2C1f140000&quantity=&ColumnSort=0&page=1&stock=1&pageSize=25>; DIGIKEY: 311-1KLDCT-ND; MF: Yageo; MPN: AC0603FR-071KL; VALUE_PART: 1k
SD1 = bschulz:MICRO_SD: Micro SD Card - Card Detect, Exposed leads for non-reflow soldering Characteristics: Number of Positions: 10 (8 + 2) Insertion/Removal: Push In, Pull Out Switch: Yes Digikey: 114-00841-68-1-ND (Amphenol) <https://www.digikey.com/product-detail/en/amphenol-icc-commercial-products/114-00841-68/114-00841-68-1-ND/2187101> HR1941CT-ND (Hirose Alternative) <https://www.digikey.com/product-detail/en/hirose-electric-co-ltd/DM3D-SF/HR1941CT-ND/1786515>; DIGIKEY: 114-00841-68-1-ND; MF: Amphenol; MPN: 114-00841-68
TP1-TP10 = bschulz:TESTPOINT; DIGIKEY: A106145CT-ND; MF: TE Connectivity; MPN: RCU-0C
U1 = bschulz:MCP794*: MCP794xx - Battery Backed I2C Real Time Clock (RTC) with SRAM (EEPROM*) and Protected EERPOM Characteristics: VCC: 1.8~5.5V VBat: 1.3~5.5V IQ: 1.2μA @ 3.3V Vcc, 925nA @ 3.0V VBat Memory: 64B, 64B Protected EEPROM, 1kB EEPROM* Interface: I2C Operating Temperature: -40°C to 85°C *Only on MCP7941x models Digikey: MCP79411, SOIC (MCP79411T-I/SNCT-ND) <https://www.digikey.com/en/products/detail/microchip-technology/MCP79411T-I-SN/2533083> MCP79412, SOIC (MCP79412-I/SN-ND) <https://www.digikey.com/en/products/detail/microchip-technology/MCP79412-I-SN/2712450> Pin Compatible Alternatives <https://www.digikey.com/products/en/integrated-circuits-ics/clock-timing-real-time-clocks/690?FV=401994%2C26802e4%2C45003ef%2C450041e%2C4500072%2C450050c%2C4500565%2C450057c%2C450057e%2C4500010%2C4500011%2C4500017%2C450017d%2C4500180%2C450004f%2C1f140000%2Cffe002b2%2C16980015%2C1698001a%2C1698001d%2C16980026%2C16980027%2C16980029%2C16980036%2C16980009&quantity=10&ColumnSort=1000011&page=2&stock=1&nstock=1&pageSize=25> Note: These are recomendations at the time, always verify pin compatability using combination of Mrk1 EyeBall and quality datasheet; DIGIKEY: MCP79412-I/SN-ND; DISP: MCP79412; MF: Microchip; MPN: MCP79412-I/SN
U2 U6 = bschulz:TPL5010: TPL5010 - Nano-Power System Timer with Watchdog Functionality Characteristics: Vdd: 1.8V ~ 5.5V IQ: 35nA (typ) Period: 100ms ~ 7200 s Operating Temperature: -40°C to 85°C Digikey: 296-38829-1-ND <https://www.digikey.com/product-detail/en/texas-instruments/TPL5010DDCT/296-38829-1-ND/5130149>; DIGIKEY: 296-38829-1-ND; MF: TI; MPN: TPL5010DDCT
U3 = bschulz:MCP23008: MCP23008 - I2C I/O Expander, 8 bit wtih interrupt and reset Characteristics: Vcc: 1.8V ~ 5.5V IOut: 25 mA IQ: 1μA Operating Temperature: -40°C to 85°C Internal Configurable Pullups Digikey: MCP23008T-E/MLCT-ND (QFN) <https://www.digikey.com/product-detail/en/microchip-technology/MCP23008T-E-ML/MCP23008T-E-MLCT-ND/7916525> MCP23008T-E/SOCT-ND (SOIC) <https://www.digikey.com/product-detail/en/microchip-technology/MCP23008T-E-SO/MCP23008T-E-SOCT-ND/5358243> MCP23008T-E/SSCT-ND (SSOP) <https://www.digikey.com/product-detail/en/microchip-technology/MCP23008T-E-SS/MCP23008T-E-SSCT-ND/5013523>; DIGIKEY: MCP23008T-E/SSCT-ND; MF: Microchip; MPN: MCP23008T-E/SS
U4 = bschulz:SHTC*: SHTCx - Digital Humidity and Temperature Sensor Characteristics (for SHTC3): Vcc: 1.62V ~ 3.6V Humidity Resolution: 0.01% RH Humidity Accuracy: ±2% RH Temperature Resolution: 0.01°C Temperature Accuracy: 0.2°C Operating Temperature: -40°C to 125°C Digikey: 1649-1100-1-ND (SHTC3) <https://www.digikey.com/product-detail/en/sensirion-ag/SHTC3/1649-1100-1-ND/8628149> 1649-1015-1-ND (SHTC1) <https://www.digikey.com/product-detail/en/sensirion-ag/SHTC1/1649-1015-1-ND/5872297>; DIGIKEY: 1649-1100-1-ND; DISP: SHTC3; MF: Sensirion; MPN: SHTC3
U5 = bschulz:TCS3400: TCS3400 - Ambient Multi-Band Light Sensor with I2C Interface Characteristics: VCC: 2.7~3.6V VIO: Vcc (TCS34001/5), 1.8V (TCS34003/7) Operating Temperature: -40°C to 70°C Digikey: TCS34003FNMCT-ND <https://www.digikey.com/products/en/sensors-transducers/optical-sensors-ambient-light-ir-uv-sensors/536?k=tcs3400&k=&pkeyword=tcs3400&sv=0&pv7=2&sf=0&FV=-8%7C536%2C1989%7C0&quantity=&ColumnSort=0&page=1&stock=1&pageSize=25>; DIGIKEY: TCS34003FNMCT-ND; MF: AMS; MPN: TCS34003FNM
U7 U8 = bschulz:MIC2005: MIC2005 - Hight Side Load Switch, with Fixed Current Limit Characteristics: Vin: 2.5v ~ 5.5v IQ: 1μA (OFF), 80μA (ON) RDS(ON): 170mΩ (Vin = 5v) UVLO: 2.25V Output Current: 500/800/1200mA Operating Temperature: -40°C to 85°C Digikey: MIC2005A-1 <https://www.digikey.com/product-detail/en/microchip-technology/MIC2005A-1YM5-TR/576-3462-1-ND/2062462>; DIGIKEY: 576-3462-1-ND; DISP: MIC2005; MF: Microchip; MPN: MIC2005A-1YM5-TR
U9 = bschulz:MIC842: Comparator with internal voltage referance (1.24V), 5V and 3.3V compatable, 20mA output current; DIGIKEY: 576-2927-1-ND; MF: Microchip; MPN: MIC842LYC5-TR
U10 = bschulz:PCA9617: PCA9617A - Level translating I2C Bus Repeater Characteristics: Vcc: 0.8V ~ 5.5V (VccA), 2.2V ~ 5.5V (VccB) IOut: 30mA IQ: 1.6mA Operating Temperature: -40°C to 85°C Digikey: 568-10211-1-ND (TSSOP8) <https://www.digikey.com/en/products/detail/nxp-usa-inc/PCA9617ADPJ/3991854?s=N4IgTCBcDaIKwDYAcBaAjABjGt6UDkARQOAIQBdAXyA>; DIGIKEY: 568-10211-1-ND; MF: NXP; MPN: PCA9617ADPJ
U11 = bschulz:SN74AUP3G34: SN74AUP3G34 - Logic Buffer Characteristics: VCC: 0.8~3.6V Operating Temperature: -40°C to 85°C Number of Gates: 3 /li> Inverting: No Digikey: 296-27503-1-ND (UQFN, RSE) <https://www.digikey.com/scripts/DkSearch/dksus.dll?Detail&itemSeq=257211059&uq=636588853324239862> 296-36973-1-ND (XFDFN, DQE) <https://www.digikey.com/product-detail/en/texas-instruments/SN74AUP3G34DQER/296-36973-1-ND/4428921> 296-25595-1-ND (VFSOP, DCU) <https://www.digikey.com/product-detail/en/texas-instruments/SN74AUP3G34DCUR/296-25595-1-ND/2202056>; DIGIKEY: 296-25595-1-ND; MF: TI; MPN: SN74AUP3G34DCUR
U12 = bschulz:SN74LVC1G3157: SN74LVC1G3157 - SPDT Analog Switch Characteristics: VCC: 1.65~5.5V Operating Temperature: -40°C to 85°C On state resistace: 15 Ω, Max Channel to Channel Matching: 0.1 Ω, Typical Digikey: 296-14909-1-ND (SC70, DCK) <https://www.digikey.com/product-detail/en/texas-instruments/SN74LVC1G3157DCKR/296-14909-1-ND/562526> 296-18015-1-ND (SOT-666, DRL) <https://www.digikey.com/product-detail/en/texas-instruments/SN74LVC1G3157DRLR/296-18015-1-ND/770530>; DIGIKEY: 296-14909-1-ND; DISP: SN74LVC1G3157; MF: TI; MPN: SN74LVC1G3157DCKR
XTAL1 = bschulz:CRYSTAL: Crystal Oscilator 2 Pin quartz crystal oscilators Variants 3.2x1.5mm (Only available in 32.768kHz) <https://www.digikey.com/products/en/crystals-oscillators-resonators/crystals/171?FV=b839bf%2Cb83a33%2C8640001%2C864000f%2C8640003%2C1f140000%2Cmu32.768kHz%7C2150%2Cffe000ab&quantity=10&ColumnSort=1000011&page=1&stock=1&k=crystal&pageSize=25&pkeyword=crystal> 5 x 3.2mm (8MHz ~ 50MHz) <https://www.digikey.com/products/en/crystals-oscillators-resonators/crystals/171?FV=402f3e%2Cb8434d%2C1f140000%2Cffe000ab&quantity=10&ColumnSort=1000011&page=1&stock=1&pageSize=25>; DIGIKEY: 535-11937-1-ND; MF: ABS07-120-32.768KHZ-T; MPN: Abracon

## Board
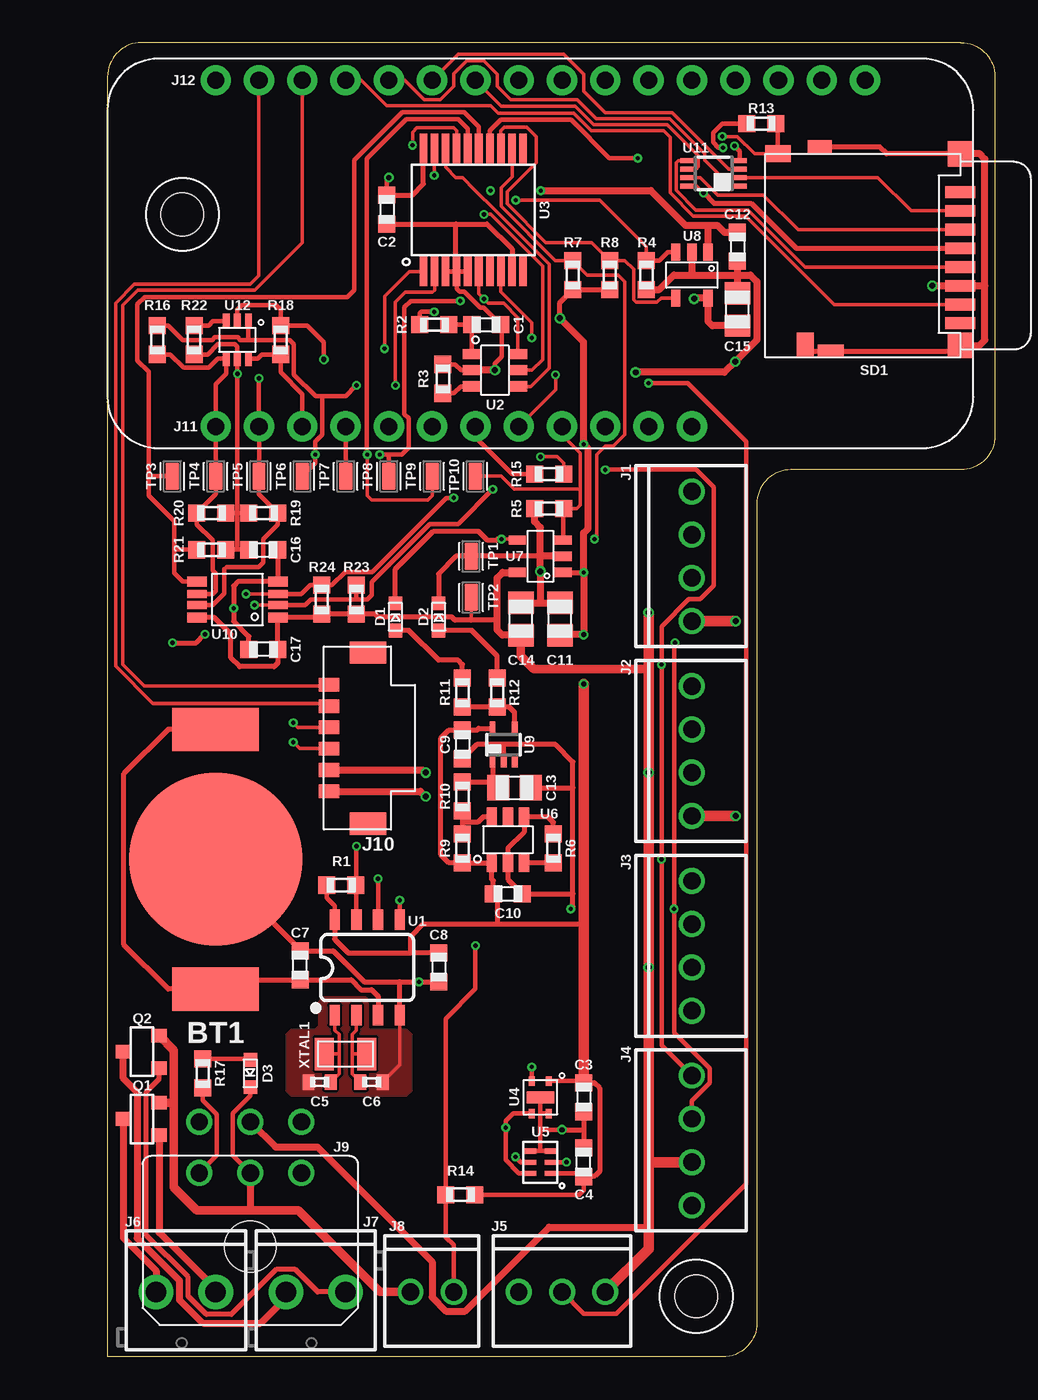
[diagram p2: board, top side]
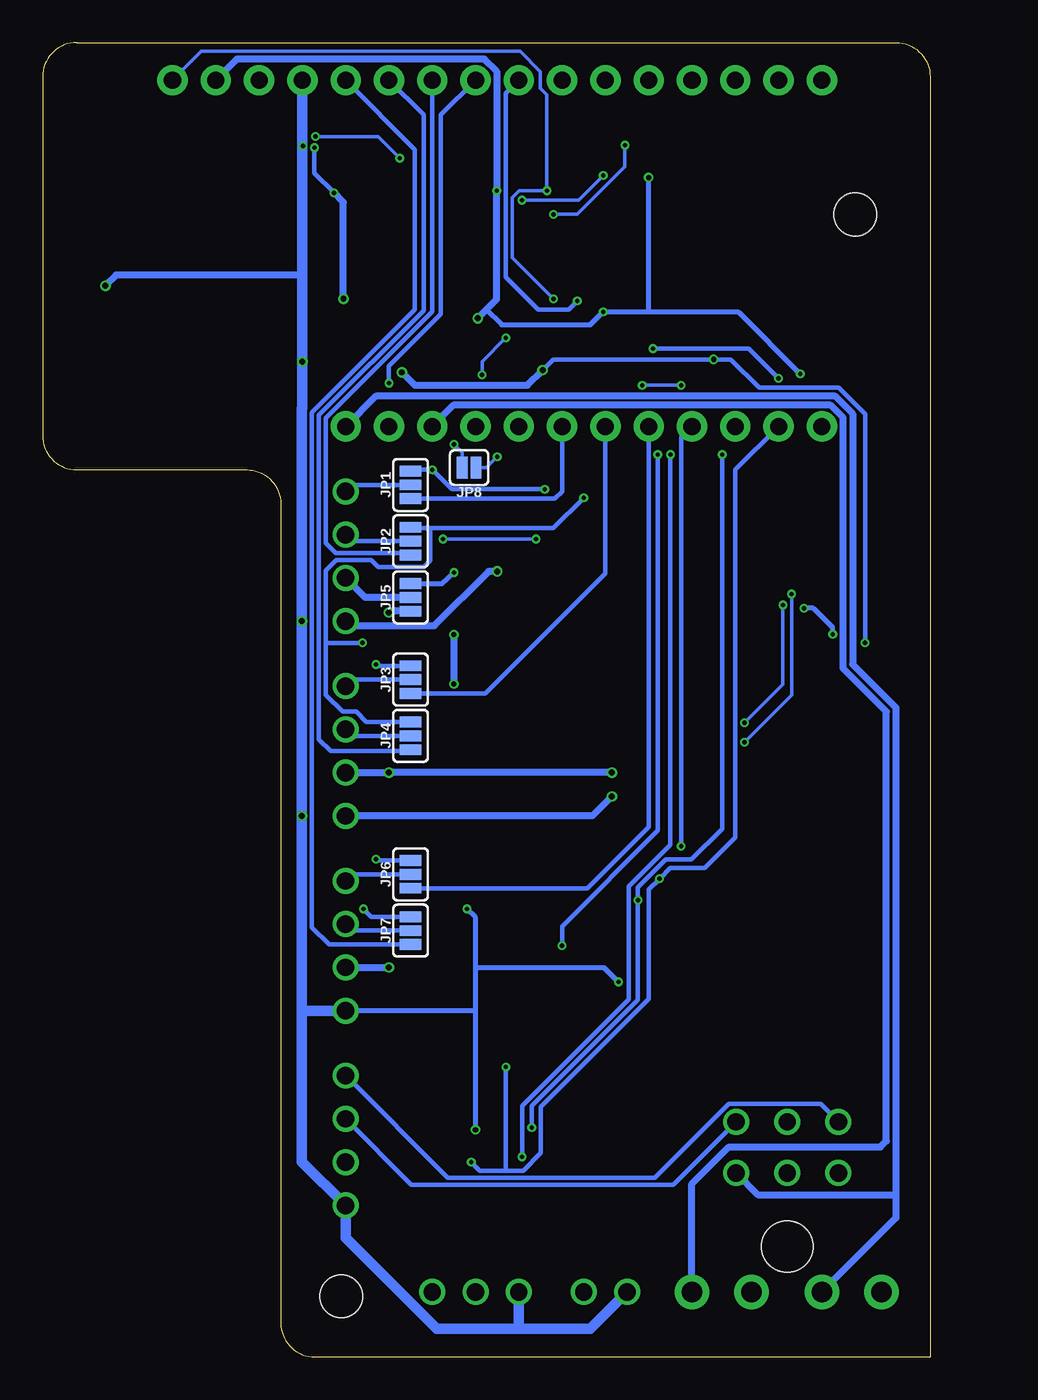
[diagram p3: board, bottom side, seen from below]

Size 52.07 x 77.14 mm. Coordinates in mm from the lower left corner, seen from the top.
Outline: 38.1,50.07 38.1,2 arc-90 36.1,0 0,0 0,75.14 arc-90 2,77.14 50.07,77.14 arc-90 52.07,75.14 52.07,54.07 arc-90 50.07,52.07 40.1,52.07 arc90 38.1,50.07
Copper layers (1*16): Top 0.035559375mm / dielectric 1.6mm / Bottom 0.035559375mm
Design rules "oshpark-2layer": minimum track width 6mil, minimum drill 10mil, track to track 6mil, track to pad 6mil, pad to pad 6mil, via to via 6mil, smd to smd 6mil, copper to edge 15mil, drill to drill 6mil, minimum pad ring 5mil, minimum via ring 5mil, stop-mask expansion 2.5mil, vias tented up to drill 0mil, thermal gap 10mil

### Footprints (pad centres in the part's own frame; a part is rotated, then mirrored left to right if it is on the bottom)
LINX_BAT-HLD-012-SMT = smd 10.16 x 10.16: GND 0,0 | smd 2.54 x 5.08: POWER0 -7.62,0; POWER1 7.62,0
C0603 = smd 1 x 1: 1 -0.85,0; 2 0.85,0
C0402 = smd 0.7 x 0.9: 1 -0.65,0; 2 0.65,0
C0805 = smd 1.3 x 1.5: 1 -0.95,0; 2 0.95,0
LED_0603 = smd 0.8 x 0.8: ANODE 0.8,0; CATHODE -0.8,0
2_56 = hole 2.5: 0,0
1X04_SCREW = drill 1.016: 1 -3.81,0; 2 -1.27,0; 3 1.27,0; 4 3.81,0
1X03_SCREW = drill 1.016: 1 -2.54,0; 2 0,0; 3 2.54,0
SCREWTERMINAL-3.5MM-2_ROUND = drill 1.2 pad 2.032: 1 0,0; 2 3.5,0
1X02_2.54_SCREWTERM_ROUND = drill 1.016: P1 1.27,0; P2 -1.27,0
2X3_MICROFIT_RT = drill 1.02: 1 3,4.32; 2 0,4.32; 3 -3,4.32; 4 3,7.32; 5 0,7.32; 6 -3,7.32 | hole 3: 0,0
1X06_MICROLOCKPLUS = smd 0.8 x 1.2: 1 -3.125,-0.6; 2 -1.875,-0.6; 3 -0.625,-0.6; 4 0.625,-0.6; 5 1.875,-0.6; 6 3.125,-0.6 | smd 1.3 x 2.15: BODY@1 -5.025,1.695; BODY@2 5.025,1.695
SMT-JUMPER_3_1-NC_PASTE_SILK = smd 0.635 x 1.27: 1 -0.813,0; 2 0,0; 3 0.813,0
SMT-JUMPER_2_NC_PASTE_SILK = smd 0.635 x 1.27: 1 -0.406,0; 2 0.406,0
FEATHERWING_MIN = drill 1 pad 1.778: 1 6.35,1.27; 2 8.89,1.27; 3 11.43,1.27; 4 13.97,1.27; 5 16.51,1.27; 6 19.05,1.27; 7 21.59,1.27; 8 24.13,1.27; 9 26.67,1.27; 10 29.21,1.27; 11 31.75,1.27; 12 34.29,1.27; 13 36.83,1.27; 14 39.37,1.27; 15 41.91,1.27; 16 44.45,1.27; 17 44.45,21.59; 18 41.91,21.59; 19 39.37,21.59; 20 36.83,21.59; 21 34.29,21.59; 22 31.75,21.59; 23 29.21,21.59; 24 26.67,21.59; 25 24.13,21.59; 26 21.59,21.59; 27 19.05,21.59; 28 16.51,21.59
SOT23-3 = smd 0.8 x 0.9: 1 -0.95,-1; 2 0.95,-1; 3 0,1.1
R0603 = smd 1 x 1: 1 -0.85,0; 2 0.85,0
CUSTOM-PARTS_SD_MICRO = smd 0.7 x 1.75: 1 -2.25,0; 2 -3.35,0; 3 -4.45,0; 4 -5.55,0; 5 -6.65,0; 6 -7.75,0; 7 -8.85,0; 8 -9.95,0 | smd 1 x 1.5: CD1 0,10.7 | smd 1.5 x 1: CD2 -11.25,9.1 | smd 1.5 x 1.5: GND@1 0,0; GND@2 -11.25,0 | smd 0.8 x 1.5: GND@3 -11.6,7.6 | smd 0.8 x 1.4: GND@5 0.4,8.25
TESTPOINT_0603 = smd 1.6 x 0.8: 1 0,0
SO08 = smd 0.6 x 1.2: 1 -1.905,-2.8; 2 -0.635,-2.8; 3 0.635,-2.8; 4 1.905,-2.8; 5 1.905,2.8; 6 0.635,2.8; 7 -0.635,2.8; 8 -1.905,2.8
DDC_R-PDSO-G6 = smd 0.6 x 1.1: 1 -0.95,-1.35; 2 0,-1.35; 3 0.95,-1.35; 4 0.95,1.35; 5 0,1.35; 6 -0.95,1.35
SSOP20 = smd 0.45 x 1.75: 1 -2.925,-3.6; 2 -2.275,-3.6; 3 -1.625,-3.6; 4 -0.975,-3.6; 5 -0.325,-3.6; 6 0.325,-3.6; 7 0.975,-3.6; 8 1.625,-3.6; 9 2.275,-3.6; 10 2.925,-3.6; 11 2.925,3.6; 12 2.275,3.6; 13 1.625,3.6; 14 0.975,3.6; 15 0.325,3.6; 16 -0.325,3.6; 17 -0.975,3.6; 18 -1.625,3.6; 19 -2.275,3.6; 20 -2.925,3.6
DFN_4_2X2 = smd 0.55 x 0.35: 1 -0.95,0.5; 2 -0.95,-0.5; 3 0.95,-0.5; 4 0.95,0.5 | smd 0.7 x 1.6: EP 0,0
TCS3400 = smd 0.75 x 0.3: 1 -0.625,0.65; 2 -0.625,0; 3 -0.625,-0.65; 4 0.625,-0.65; 5 0.625,0; 6 0.625,0.65
SOT23-5 = smd 0.55 x 1: 1 -0.95,-1.35; 2 0,-1.35; 3 0.95,-1.35; 4 0.95,1.35; 5 -0.95,1.35
DCK_R-PDSO-G5 = smd 0.35 x 0.8: 1 -0.65,-0.95; 2 0,-0.95; 3 0.65,-0.95; 4 0.65,0.95; 5 -0.65,0.95
TSSOP_8 = smd 0.6 x 1.15: 1 -1.05,-2.375; 4 1.05,-2.375; 5 1.05,2.375; 8 -1.05,2.375 | smd 0.45 x 1.15: 2 -0.325,-2.375; 3 0.325,-2.375; 6 0.325,2.375; 7 -0.325,2.375
DCU_(R-PDSO-G8) = smd 0.3 x 0.8: 1 -0.75,-1.55; 2 -0.25,-1.55; 3 0.25,-1.55; 4 0.75,-1.55; 5 0.75,1.55; 6 0.25,1.55; 7 -0.25,1.55; 8 -0.75,1.55
DCK_R-PDSO-G6 = smd 0.4 x 0.9: 1 -0.65,-1.1; 2 0,-1.1; 3 0.65,-1.1; 4 0.65,1.1; 5 0,1.1; 6 -0.65,1.1
CRYSTAL_3.2X1.5_2-SMD = smd 1.1 x 1.9: P$1 -1.25,0; P$2 1.25,0

### Placement (x,y rotation side)
BT1  6.35,29.21 90 top
C1  22.23,60.58 0 top
C2  16.38,67.35 270 top
C3  27.94,15.24 270 top
C4  27.94,11.43 90 top
C5  12.45,16.13 180 top
C6  15.49,16.13 0 top
C7  11.3,22.99 90 top
C8  19.43,22.86 270 top
C9  20.83,35.94 270 top
C10  23.5,27.18 0 top
C11  26.54,43.31 90 top
C12  36.96,65.15 270 top
C13  23.88,33.4 0 top
C14  24.26,43.31 90 top
C15  36.96,61.47 90 top
C16  9.14,47.37 0 top
C17  9.14,41.53 180 top
D1  16.89,43.43 270 top
D2  19.43,43.43 270 top
D3  8.38,16.64 90 top
H1  4.39,67.06 0 top
H2  34.54,3.56 0 top
J1  34.29,46.99 270 top
J2  34.29,35.56 270 top
J3  34.29,24.13 270 top
J4  34.29,12.7 270 top
J5  26.67,3.81 180 top
J6  6.35,3.81 180 top
J7  13.97,3.81 180 top
J8  19.05,3.81 0 top
J9  8.38,6.48 0 top
J10  13.59,36.32 270 top
JP1  30.48,51.18 90 bottom
JP2  30.48,47.88 90 bottom
JP3  30.48,39.75 90 bottom
JP4  30.48,36.45 90 bottom
JP5  30.48,44.58 270 bottom
JP6  30.48,28.32 90 bottom
JP7  30.48,25.02 90 bottom
JP8  27.05,52.2 180 bottom
MS1  50.8,76.2 180 top
Q1  2.03,13.97 90 top
Q2  2.03,17.91 90 top
R1  13.72,27.69 180 top
R2  19.18,60.58 180 top
R3  19.68,57.4 270 top
R4  31.62,63.5 90 top
R5  25.91,49.78 0 top
R6  26.16,29.84 270 top
R7  27.3,63.5 270 top
R8  29.46,63.5 270 top
R9  20.83,29.84 270 top
R10  20.83,32.89 90 top
R11  20.83,38.99 270 top
R12  22.86,38.99 270 top
R13  38.35,72.39 180 top
R14  20.7,9.53 180 top
R15  25.91,51.82 0 top
R16  2.92,59.69 90 top
R17  5.59,16.64 270 top
R18  10.16,59.69 270 top
R19  9.14,49.53 180 top
R20  6.1,49.53 0 top
R21  6.1,47.37 0 top
R22  5.08,59.69 270 top
R23  14.61,44.45 270 top
R24  12.57,44.45 270 top
SD1  50.04,70.61 90 top
TP1  21.34,46.99 90 top
TP2  21.34,44.58 90 top
TP3  3.81,51.69 90 top
TP4  6.35,51.69 90 top
TP5  8.89,51.69 90 top
TP6  11.43,51.69 90 top
TP7  13.97,51.69 90 top
TP8  16.51,51.69 90 top
TP9  19.05,51.69 90 top
TP10  21.59,51.69 90 top
U1  15.24,22.86 0 top
U2  22.73,57.91 270 top
U3  21.46,67.31 0 top
U4  25.4,15.24 270 top
U5  25.4,11.43 180 top
U6  23.5,30.35 0 top
U7  25.4,46.99 90 top
U8  34.29,63.5 180 top
U9  23.24,35.94 0 top
U10  7.62,44.45 90 top
U11  35.56,69.47 90 top
U12  7.62,59.69 180 top
XTAL1  13.97,17.78 0 top

### Tracks (layer width: path | path; a pad name or v marks a point on that pad's centre or on a via)
3V3  (via drill 0.25, 0.3, 0.35)
  Top 0.254: R22.2 5.88,58.84 6.48,59.44 7.47,59.44 7.62,59.28 U12.5 v7.62,57.69 7.62,49.53 | U4.1 27.84,16.19 C3.1 | U5.1 27.79,10.78 27.94,10.63 27.94,9.78 27.69,9.53 R14.1 | R1.2 12.87,26.92 13.34,26.45 13.34,25.53 | v16.51,69.22 16.38,69.09 C2.1 | R21.2 7.62,47.37 | 7.62,47.37 C16.1 | R20.2 7.62,49.53 | R19.2 7.62,49.53 | 7.62,47.37 7.62,49.53 | v19.18,61.34 18.41,61.34 18.33,61.25 R2.2
  Top 0.305: U1.8 13.34,25.53 13.34,24.51 14.14,23.71 17.78,23.71 | C8.1 17.78,23.71 | C3.1 28.56,16.09 28.87,15.78 28.87,10.89 28.61,10.63 27.94,10.63 | U7.1 v27.94,46.04 | R8.2 R7.2 26.54,61.89 v26.54,60.96 | U9.5 21.78,36.89 21.68,36.79 C9.1 20.03,36.79 19.56,36.32 19.56,29.46 20.03,29 R9.2 22.54,29 U6.1 22.55,28.04 22.64,27.94 C10.1 22.86,26.96 22.86,25.4 | C2.1 17.9,68.2 18.54,68.83 U3.20 | 17.78,23.71 17.78,24.64 18.54,25.4 22.86,25.4 | 22.86,25.4 27.94,25.4
  Top 0.406: v26.54,60.96 27.94,59.56 v27.94,53.57 28.19,53.31 28.19,48.61 27.94,48.36 v27.94,46.04 v27.94,42.39 26.58,42.39 C11.1 | v25.43,68.45 31.88,68.45 33.91,66.42 35.18,66.42 | C12.1 36.2,66 35.77,66.42 35.18,66.42 | U8.1 35.24,66.36 35.18,66.42
  Top 0.61: v27.94,39.49 27.94,25.4 C3.1 | 27.94,10.63 C4.1
  Bottom 0.2: JP8.2 27.46,53.08 v27.94,53.57
  Bottom 0.305: 26.04,61.47 25.15,60.58 19.94,60.58 v19.18,61.34 16.51,61.34 | v7.62,57.69 11.27,61.34 16.51,61.34 | 16.51,61.34 v16.51,69.22 | JP5.1 28.65,45.39 v27.94,46.04
  Bottom 0.406: v27.94,42.39 v27.94,39.49 | v26.54,60.96 26.04,61.47 25.43,62.08 v25.43,68.45 25.43,75.45 26.15,76.17 40.66,76.17 MS1.2
3V3_EXT  (via drill 0.35)
  Top 0.2: TP2.1 21.34,43.24
  Top 0.305: 22.86,43.18 22.8,43.24 21.34,43.24 20.39,43.24 20.19,43.43 15.88,43.43 15.71,43.6 R23.2 R24.2 12.41,43.43 10.03,43.43 U10.1 C17.1 9.99,40.73 9.78,40.51 7.75,40.51 7.24,41.02 7.24,42.42 6.26,43.4 U10.8
  Top 0.406: C14.1 23.18,42.36 22.86,42.67 22.86,43.18 22.86,45.72 23.18,46.04 U7.5 | J9.5 9.86,12.32 12.32,12.32 19.05,5.59 19.05,3.5 19.86,2.69 20.98,2.69 25.91,7.62 31.75,7.62 | J10.5 18.51,34.45 v18.67,34.29
  Top 0.508: C14.1 24.26,41.15 25.02,40.39 31.75,40.39
  Top 0.61: J5.1 31.75,6.35 31.75,7.62 31.75,11.43 | v31.75,43.69 31.75,40.39 v31.75,34.29 v31.75,22.86 31.75,11.43 | J4.3 31.75,11.43
  Bottom 0.406: J2.3 v31.75,34.29 v18.67,34.29 | J3.3 v31.75,22.86 | JP5.3 31.67,43.76 v31.75,43.69
3V3_EXT_EN
  Top 0.2: MS1.25 26.67,54.1 27.74,53.03 27.74,50.93 | 27.74,50.93 27.74,50 27.52,49.78 R5.2 | TP10.1 23.11,51.69 23.88,50.93 27.74,50.93
  Top 0.254: U7.3 R5.2
3V3_EXT_FAULT  (via drill 0.25)
  Top 0.2: U7.4 23.98,48.01 v23.11,48.01 | v28.57,48.01 28.7,48.13 28.7,52.96 29.21,53.47 29.68,53.47 30.35,54.14 30.35,63.12 29.97,63.5 28.16,63.5 R7.1 26.28,64.35 23.09,67.54 23.09,68.61 23.74,69.26 U3.12
  Top 0.305: D1.CATHODE 16.89,46.23 19.13,48.46 21.77,48.46 22.28,47.95 22.84,47.95 22.89,48.01 v23.11,48.01
  Bottom 0.2: v28.57,48.01 v23.11,48.01
3V3_SD  (via drill 0.25, 0.35)
  Top 0.2: U11.8 34.58,68.72 v34.97,68.32
  Top 0.254: v36.12,70.97 35.85,70.97 35.53,71.28 35.53,71.85 36.08,72.39 R13.2
  Top 0.305: v34.97,68.32 35.58,67.72 37.77,67.72 40.42,65.06 SD1.4
  Top 0.406: v34.42,62.1 34.46,62.15 U8.5 35.24,60.77 35.49,60.52 C15.1
  Bottom 0.254: v34.97,68.32 36.12,69.47 v36.12,70.97
  Bottom 0.406: v34.42,62.1 34.42,67.77 v34.97,68.32
3V3_SD_EN  (via drill 0.25)
  Top 0.2: R4.2 31.62,65.15 28.88,67.89 v23.95,67.89 | v19.18,69.34 19.18,70.9 U3.19
  Top 0.254: R4.2 32.38,64.35 32.88,64.85 U8.3
  Bottom 0.2: v19.18,69.34 20.62,67.89 v23.95,67.89
3V3_SD_FAULT
  Top 0.2: U8.4 32.48,62.15 32.23,61.9 31.02,61.9 30.87,62.05 30.87,63.83 30.35,64.35 R8.1 28.41,65.41 25.73,65.41 23.45,67.68 23.45,68.4 25.15,70.1 25.15,71.61 24.59,72.16 23.28,72.16 23.09,71.97 U3.13
DATA1
  Bottom 0.254: JP1.2 33.91,51.18 J1.1
DATA2
  Bottom 0.254: JP2.2 33.91,47.88 J1.2
DATA3
  Bottom 0.254: JP3.2 33.91,39.75 J2.1
DATA4
  Bottom 0.254: JP4.2 33.91,36.45 J2.2
DATA5
  Bottom 0.254: JP6.2 33.91,28.32 J3.1
DATA6
  Bottom 0.254: JP7.2 33.91,25.02 J3.2
GND  (via drill 0.25, 0.3, 0.35)
  Top 0.2: U1.4 17.14,17.13 C6.2
  Top 0.254: U5.4 25.4,12.08 | 25.4,12.08 U5.3 | R3.1 20.41,58.25 20.75,57.91 U2.2 | v22.73,57.91 22.73,58.3 23.14,58.71 23.14,60.52 C1.2 22.08,61.57 21.88,61.57 20.94,62.51 20.68,62.51 20.49,62.7 U3.4 | v12.7,58.55 12.7,59.56 11.72,60.54 R18.1 10.16,61.47 9.91,61.72 7.87,61.72 7.62,61.47 U12.2 | U11.4 37.11,70.76 v36.79,71.08 | U4.EP 25.4,14.29 | 25.4,14.29 25.4,13.34 | 25.4,13.34 25.4,12.08 | U4.4 25.4,14.29 | v26.67,13.34 25.4,13.34 | U3.3 U3.4 | U3.4 U3.5 | D3.CATHODE 8.38,15.33 7.34,14.29 7.34,11.84 J9.2
  Top 0.305: 17.14,22.01 15.06,22.01 13.23,23.84 C7.2 11.3,23.88 6.35,28.83 BT1.GND | 17.14,22.01 v18.29,22.01 C8.2 | U1.4 17.14,22.01 | C3.2 27.94,13.34 | 27.94,13.34 C4.2 | v26.67,13.34 27.94,13.34 | SD1.GND@1 45.72,70.61 45.32,71.01 SD1.GND@5 | SD1.GND@2 49.69,59.01 SD1.GND@3 41.29,59.01 SD1.CD2 | 25.4,46.99 TP1.1 20.45,46.99 19.43,45.97 D2.CATHODE | C9.2 21.68,35.94 23.24,35.94 | 27.3,27.18 27.3,33.4 | 27.3,33.4 27.3,34.92 26.29,35.94 23.24,35.94 | U9.2 23.24,35.94 | C13.2 27.3,33.4 | R6.1 26.16,31.37 25.83,31.7 U6.4 24.45,30.8 23.5,29.84 U6.2 23.5,28.03 C10.2 27.3,27.18 | C2.2 20.45,66.5 | 20.45,66.5 22.28,66.5 23.74,65.03 U3.9 | U3.4 20.45,63.75 20.45,66.5 | C17.2 8.29,42.29 7.41,43.18 v7.41,43.94 7.41,45.25 7.65,45.5 U10.4 C16.2 | v3.81,41.91 5.21,41.91 v5.71,42.42 | v27.18,26.29 27.3,26.42 27.3,27.18
  Top 0.406: C12.2 36.96,63.5 | 36.96,63.5 C15.2 | R4.1 32.38,62.65 33.23,63.5 34.29,63.5 | 34.29,63.5 36.96,63.5 | U8.2 34.29,63.5 | v30.99,57.78 36.2,57.78 v36.83,58.42 38.1,59.69 38.1,63.12 37.72,63.5 36.96,63.5 | v22.73,57.91 U2.2 | SD1.GND@2 51.16,59.36 51.49,59.69 51.49,62.87 | 51.49,62.87 51.49,70.31 51.18,70.61 SD1.GND@1 | 51.49,62.87 51.48,62.86 SD1.6 v48.39,62.87 | R5.1 25.06,49.02 25.4,48.68 25.4,47.12 | 25.4,47.12 25.4,46.99 v25.4,46.1 25.4,44.26 | 25.4,47.12 25.53,46.99 U7.2 | C14.2 25.4,44.26 | 25.4,44.26 C11.2 | J9.2 8.38,8.61 | J10.6 18.36,33.2 v18.67,32.89
  Top 0.508: Q2.2 3.89,18 3.89,14.99 | J8.P2 15.98,3.81 11.18,8.61 8.38,8.61 5.23,8.61 3.89,9.96 3.89,14.99 | Q1.2 3.82,14.92 3.89,14.99
  Top 0.61: J1.4 v36.85,43.18 | J2.4 v36.85,31.75
  Bottom 0.254: v22.73,57.91 22.1,58.55 v12.7,58.55 11.68,58.55 10.03,56.9 5.36,56.9 3.81,55.35 v3.81,41.91 | v36.79,71.08 36.83,71.12
  Bottom 0.305: v26.67,13.34 26.67,20.32 | 26.67,20.32 26.67,22.86 | 26.67,22.86 19.14,22.86 v18.29,22.01 | 26.67,20.32 J3.4 | v5.71,42.42 5.71,42.8 6.86,43.94 v7.41,43.94 | v27.18,26.29 26.67,25.78 26.67,22.86
  Bottom 0.406: J1.4 34.04,42.93 29.08,42.93 25.91,46.1 v25.4,46.1 | v30.99,57.78 30.23,57.02 23.62,57.02 v22.73,57.91 | 36.83,63.5 47.75,63.5 v48.39,62.87 | v18.67,32.89 19.81,31.75 J2.4
  Bottom 0.61: MS1.4 36.83,71.12 36.83,63.5 v36.83,58.42 36.83,55.7 36.85,55.67 v36.85,43.18 v36.85,31.75 36.85,20.32 | 36.85,20.32 36.85,11.46 J4.4 34.29,6.99 28.96,1.65 24.13,1.65 | J3.4 36.85,20.32 | 24.13,1.65 19.94,1.65 J8.P2 | 24.13,1.65 J5.3
  pour Top (no thermals): 10.79,19.18 12.2,19.18 12.45,19.42 12.45,20.83 12.7,21.08 15.11,21.08 15.24,20.95 15.24,19.3 15.36,19.18 17.53,19.18 17.78,18.92 17.78,15.62 17.53,15.37 10.79,15.37 10.54,15.62 10.54,18.92
GPIO1A
  Bottom 0.254: JP2.1 30.61,47.19 34.87,47.19 35.46,47.78 35.46,55.09 29.21,61.34 MS1.7
GPIO1D
  Top 0.254: R15.1 23.75,51.82 21.59,53.98 MS1.23
  Bottom 0.254: MS1.23 21.59,50.8 22.02,50.37 JP1.1
GPIO2A
  Bottom 0.254: MS1.6 29.72,72.9 29.72,61.41 35.87,55.26 35.87,36.25 35.18,35.56 30.56,35.56 JP4.1
GPIO2D
  Bottom 0.254: MS1.22 19.05,45.97 26.09,38.94 JP3.1
GPIO3A
  Bottom 0.254: MS1.5 30.23,70.87 30.23,61.48 36.27,55.43 36.27,25.22 35.26,24.21 JP7.1
GPIO3D
  Bottom 0.254: MS1.21 16.51,31.11 20.12,27.51 JP6.1
GPIOXA  (via drill 0.25)
  Top 0.254: J5.2 27.94,2.54 29.84,2.54 37.47,10.16 37.47,53.72 34.04,57.15 v31.75,57.15
  Bottom 0.254: v31.75,57.15 31.75,58.17 28.7,61.21 28.7,72.9 MS1.8
I2C_EXT_EN
  Top 0.254: U3.15 21.79,72.19 20.93,73.05 17.3,73.05 14.48,70.23 14.48,62.61 14.07,62.21 2.18,62.21 1.76,61.79 1.76,58.48 2.41,57.83 2.41,51.69 | 3.91,47.37 3.91,49.05 2.41,50.55 2.41,51.69 | R21.1 3.91,47.37 | TP3.1 2.41,51.69 | U10.5 4.41,45.5 3.91,46 3.91,47.37
IO_EXP_INT  (via drill 0.25)
  Top 0.2: U3.8 23.09,62.51 24.89,60.71 v24.89,59.82 | v26.29,57.63 26.29,56.77 MS1.24
  Bottom 0.2: v24.89,59.82 26.29,58.42 v26.29,57.63
MISO
  Top 0.2: SD1.7 42.65,61.76 37.46,66.96 34.37,66.96 33.01,68.32 33.01,71.6 32.64,71.97 28.38,71.97 27.36,72.98 22.94,72.98 22.49,73.44 16.39,73.44 14.9,74.93 MS1.13
MOSI
  Top 0.2: U11.1 36.56,68.72 35.05,70.23 35.05,70.62 33,72.67 28.67,72.67 27.56,73.79 23.66,73.79 22.86,74.59 22.86,75.28 22.06,76.07 21.08,76.07 20.32,75.31 20.32,74.58 19.52,73.79 18.58,73.79 17.44,74.93 MS1.12
MOSI_BUF
  Top 0.2: SD1.3 40.52,66.16 38.48,68.2 35.81,68.2 34.79,69.22 U11.7
N$1
  Top 0.2: U1.1 13.34,19.18 13.59,18.92 13.59,17.78 | 13.59,17.78 13.59,16.62 C5.1 | XTAL1.P$1 13.59,17.78
N$2
  Top 0.2: U1.2 14.61,19.18 14.35,18.92 14.35,17.78 | 14.35,17.78 14.35,16.62 C6.1 | XTAL1.P$2 14.35,17.78
N$3
  Top 0.254: U2.3 20.73,56.96 20.32,56.55 R3.2
N$4
  Top 0.254: U12.3 6.18,60.79 5.93,60.54 R22.1
N$5  (via drill 0.25)
  Top 0.2: R15.2 26.76,52.45 26.38,52.83 v25.4,52.83
  Bottom 0.2: v25.4,52.83 26.04,52.2 JP8.1
N$6
  Top 0.254: U2.1 C1.1 R2.1
N$7
  Top 0.305: R6.2 U6.3
N$8
  Top 0.305: R10.2 22.58,33.74 C13.1 22.59,33.74 U9.1
N$9
  Top 0.305: R10.1 20.83,31.37 | 20.83,31.37 R9.1 | U6.6 22.05,31.7 21.72,31.37 20.83,31.37
N$10
  Top 0.305: U9.4 23.89,37.83 23.58,38.14 R12.2 R11.2
N$11
  Top 0.305: R11.1 20.83,40.64 20.57,40.89 19.43,40.89 17.69,42.63 D1.ANODE
N$12
  Top 0.305: R12.1 22.86,41.15 21.37,42.63 D2.ANODE
N$13
  Top 0.254: J9.3 6.43,11.84 6.43,14.23 5.59,15.07 R17.2
N$14
  Top 0.254: R17.1 8.33,17.49 D3.ANODE
PAR_INT  (via drill 0.25)
  Top 0.2: v15.24,52.96 15.24,50.55 15.49,50.29 18.8,50.29 19.05,50.55 TP9.1
  Top 0.254: U5.5 24.25,11.43 v23.94,11.74 | v15.24,52.96 15.21,52.98 15.21,70.33 17.53,72.64 20.57,72.64 21.14,72.08 U3.16
  Bottom 0.254: v23.94,11.74 23.94,14.74 17.68,21 17.68,27.6 15.24,30.04 v15.24,52.96
PWR_P1
  Bottom 0.406: JP5.2 33.15,44.58 J1.3
RST  (via drill 0.25)
  Top 0.2: U2.6 24.08,61.01 23.24,61.85 22.35,61.85 v22.1,62.1 21.79,62.41 U3.6
  Bottom 0.2: MS1.1 42.75,76.63 24.05,76.63 22.86,75.44 22.86,74.46 22.48,74.08 v22.48,68.45 24.11,68.45 24.51,68.05 24.51,64.52 v22.1,62.1
RTC_INT  (via drill 0.25)
  Top 0.254: TP7.1 MS1.20 | R1.1 14.61,27.65 | 14.61,27.65 U1.7 | v14.61,29.97 14.61,27.65
  Bottom 0.254: v14.61,29.97 14.61,53.98 MS1.20
RX
  Top 0.2: J10.1 12.91,39.37 2.16,39.37 0.89,40.64 0.89,61.72 1.78,62.61 8.64,62.61 11.43,65.41 MS1.14
SCK
  Top 0.2: MS1.11 20.57,76.45 26.76,76.45 27.94,75.27 27.94,74.28 29.2,73.03 33.15,73.03 36.45,69.72 U11.3
SCK_BUF
  Top 0.2: SD1.5 40.95,63.96 37.6,67.31 34.51,67.31 33.36,68.46 33.36,70.1 33.48,70.22 U11.5
SCL  (via drill 0.25)
  Top 0.2: v16.26,59.18 16.26,62.27 17.7,63.71 U3.1
  Top 0.254: v15.88,28.07 U1.6 | U5.2 v26.92,11.43 | U4.2 v24.9,17.01 v24.89,17.02 | v8.89,57.43 MS1.18 8.92,54.58 8.92,51.69 TP5.1 8.89,50.63 R19.1 9.99,48.86 9.14,48.01 9.14,46.61 8.89,46.35 6.99,46.35 6.86,46.23 6.86,44.81 6.18,44.12 U10.7
  Bottom 0.254: MS1.18 11.43,52.07 11.43,30.48 13.21,28.7 15.24,28.7 v15.88,28.07 16.51,27.43 16.51,21.02 22.84,14.69 22.84,11.96 23.88,10.92 24.89,10.92 | v26.92,11.43 26.42,10.92 24.89,10.92 | v24.89,17.02 24.89,10.92 | v16.26,59.18 10.64,59.18 v8.89,57.43
SCL_EXT  (via drill 0.25)
  Top 0.2: J10.3 11.16,36.95 v10.9,37.21 | U10.2 v8.63,44.12
  Top 0.254: v22.61,50.93 20.57,48.9 18.92,48.9 15.49,45.47 15.49,44.7 15.24,44.45 14.61,44.45 | v29.21,52.07 34.54,52.07 35.56,51.05 35.56,45.26 34.77,44.48 34.11,44.48 32.51,42.88 v32.51,40.64 v32.51,29.21 32.51,18.29 J4.1 | U10.2 11.61,44.12 11.94,44.45 14.61,44.45 | R23.1 14.61,44.45
  Bottom 0.2: v10.9,37.21 8.63,39.47 v8.63,44.12
  Bottom 0.254: v22.61,50.93 28.07,50.93 v29.21,52.07 30.4,52.07 JP1.3 | v32.51,40.64 32.44,40.56 JP3.3 | v32.51,29.21 32.44,29.13 JP6.3 | J4.1 28.3,10.52 16.14,10.52 11.81,14.84 6.43,14.84 J9.6
SD_CD  (via drill 0.25)
  Top 0.2: v36.07,71.63 36.96,71.63 37.97,70.61 SD1.CD1
  Top 0.254: R13.1 39.34,72.26 SD1.CD1 | v31.11,70.36 29.45,70.36 27.21,72.6 23.07,72.6 22.44,71.97 U3.14
  Bottom 0.2: v31.11,70.36 32.38,71.63 v36.07,71.63
SD_CS
  Top 0.2: MS1.10 23.11,73.41 27.44,73.41 28.53,72.32 32.85,72.32 34.67,70.5 34.67,69.85 34.54,69.72 U11.6
SD_CS_BUF
  Top 0.2: U11.2 45.21,69.22 47.16,67.26 SD1.2
SDA
  Top 0.254: R16.1 3.68,58.84 4.46,58.06 5.93,58.06 6.46,58.59 U12.4 6.97,57.7 6.35,57.08 MS1.17 TP4.1 6.35,50.63 R20.1 5.25,48.86 6.17,47.94 6.17,46.16 6.35,45.97 6.35,44.96 6.17,44.77 U10.6
SDA_CTRL
  Top 0.254: MS1.19 11.43,56.52 10.16,57.78 R18.2 9.06,58.84 8.81,58.59 U12.6
SDA_EXT  (via drill 0.25)
  Top 0.2: J10.4 11.27,35.7 v10.9,36.07 | v8.13,44.77 10.16,44.77
  Top 0.254: v33.3,41.91 33.25,41.86 v33.25,26.29 33.25,19.02 35.33,16.94 35.33,16.08 34.29,15.04 J4.2 | v20.32,50.42 19.87,50.42 15.53,46.08 13.95,46.08 13.17,45.3 R24.1 11.9,45.3 11.37,44.77 10.16,44.77 U10.3
  Bottom 0.2: v10.9,36.07 8.13,38.84 v8.13,44.77
  Bottom 0.254: 29.34,48.64 30.43,48.64 JP2.3 | 29.34,48.64 22.1,48.64 v20.32,50.42 | 35.46,41.91 35.46,46.15 34.85,46.76 32.79,46.76 32.38,46.35 29.72,46.35 29.34,46.73 29.34,48.64 | 35.46,41.91 35.46,38.86 34.47,37.87 33.68,37.87 33.07,37.26 JP4.3 | 35.46,41.91 v33.3,41.91 | JP7.3 32.79,25.83 v33.25,26.29 | J4.2 30.43,10.11 15.07,10.11 J9.4
SDA_OB  (via drill 0.25)
  Top 0.2: v16.89,57.02 16.89,61.9 17.48,62.48 19.05,62.48 19.19,62.62 U3.2
  Top 0.254: v17.14,26.8 U1.5 | U4.3 23.82,14.29 23.37,13.84 v23.37,13.46 23.37,11.56 24.14,10.78 U5.6 | TP6.1 12.19,52.45 v12.19,52.96 12.19,53.72 12.6,54.13 12.6,56.39 | 8.26,59.69 7.79,59.69 7.64,59.84 6.31,59.84 6.16,59.69 4.41,59.69 3.56,60.54 R16.2 | U12.1 8.27,59.7 8.26,59.69 | 12.6,56.39 13.97,56.39 v14.61,57.02 | 12.6,56.39 12.21,56.39 10.94,57.66 10.94,59.46 10.71,59.69 8.26,59.69
  Bottom 0.2: v16.89,57.02 v14.61,57.02
  Bottom 0.254: v12.19,52.96 12.19,31 14,29.18 15.52,29.18 17.14,27.56 v17.14,26.8 17.14,20.95 23.37,14.73 v23.37,13.46
TIP  (via drill 0.25)
  Top 0.254: J8.P1 20.32,6.57 19.85,7.03 R14.2 19.85,19.85 21.59,21.59 v21.59,24.13 | v15.98,52.96 16.51,52.96 | 16.51,52.96 17.27,52.96 17.68,53.37 17.68,55.09 17.42,55.35 17.42,61.61 17.79,61.98 v20.7,61.98 | TP8.1 16.51,52.96
  Bottom 0.254: v15.98,52.96 15.98,30.89 21.59,25.27 v21.59,24.13 | v20.7,61.98 21.21,61.47 22.99,61.47 24.89,63.37 24.89,74.17 MS1.9
TX
  Top 0.2: J10.2 12.83,38.35 2.67,38.35 0.48,40.54 0.48,61.86 1.59,62.96 8.38,62.96 8.89,63.47 MS1.15
VBAT
  Top 0.305: BT1.POWER1 3.56,36.83 0.96,34.23 0.96,24.19 3.56,21.59 BT1.POWER0 6.9,22.14 C7.1 14.29,22.14 14.87,21.55 15.49,21.55 15.88,21.17 U1.3
VBAT-
  Top 0.406: Q1.3 0.93,6.99 2.85,5.07 J6.2
VBAT_FEATHER
  Top 0.406: Q1.1 3.03,7.3 6.35,3.99 J6.1
  Bottom 0.406: MS1.28 32.49,56.41 5.6,56.41 4.55,55.36 4.55,40.64 2.01,38.1 2.01,9.53 | J6.1 2.01,8.15 2.01,9.53 | J9.1 10.11,9.53 2.01,9.53
VBUS_FEATHER
  Top 0.305: Q2.1 3.03,16.32 2.28,15.57 2.28,7.15 4.73,4.7 4.73,3.56 5.8,2.49 7.27,2.49 9.91,5.13 11.02,5.13 12.34,3.81 J7.1
  Bottom 0.406: MS1.26 27.96,55.85 5.83,55.85 5.11,55.13 5.11,40.41 2.56,37.87 2.56,12.68 2.92,12.32 11.81,12.32 13.97,10.16 J7.1
VSYS-
  Top 0.406: J7.2 10.47,3.45 9,1.98 5.59,1.98 4.22,3.35 4.22,4.49 1.74,6.97 1.74,15.53 0.93,16.34 Q2.3
WAKE  (via drill 0.25)
  Top 0.2: U2.5 24.89,57.91 25.53,58.55 25.53,64.03 22.5,67.06 v22.1,67.06 | v17.91,71.12 17.91,71.88 18.16,72.14 20.32,72.14 20.49,71.97 U3.17
  Bottom 0.2: v17.91,71.12 17.91,69.85 20.7,67.06 v22.1,67.06
WD_HOLD
  Top 0.2: U2.4 24.83,56.96 25.91,58.04 25.91,64.14 22.8,67.25 | U3.18 19.84,69.82 20.45,69.22 20.84,69.22 21.53,68.52 22.8,67.25 | 22.8,67.25

### Text on the board
tNames: J12 | J11
Document: (1 3/16 in) | (2.5 in)
tDocu: D1 | D2 | 3v3 | FAULT | PWR | GND | D3 | D4 | 3v3 | GND | D5 | D6 | 3v3 | GND | SCL | SDA | 3v3 | BAT- | BAT+ | SYS- | SYS+ | GND | GND | TIP | GND | P1 | 3v3
bDocu: Project Hyena / v1.0A / Bobby Schulz / UMN/GEMS | Sense In | PORT1 | Core | Ext | SCL | GPIO | SDA | GPIO | Sense In | PORT2 | Sense In | PORT3 | I2C In | Bat In\ | 5v In | Tip In | Pot In